# EAGLE board TeenScience-RevB3 (EAGLE 9.5.0), part 1 of 4
TeenScience Teensy Platform
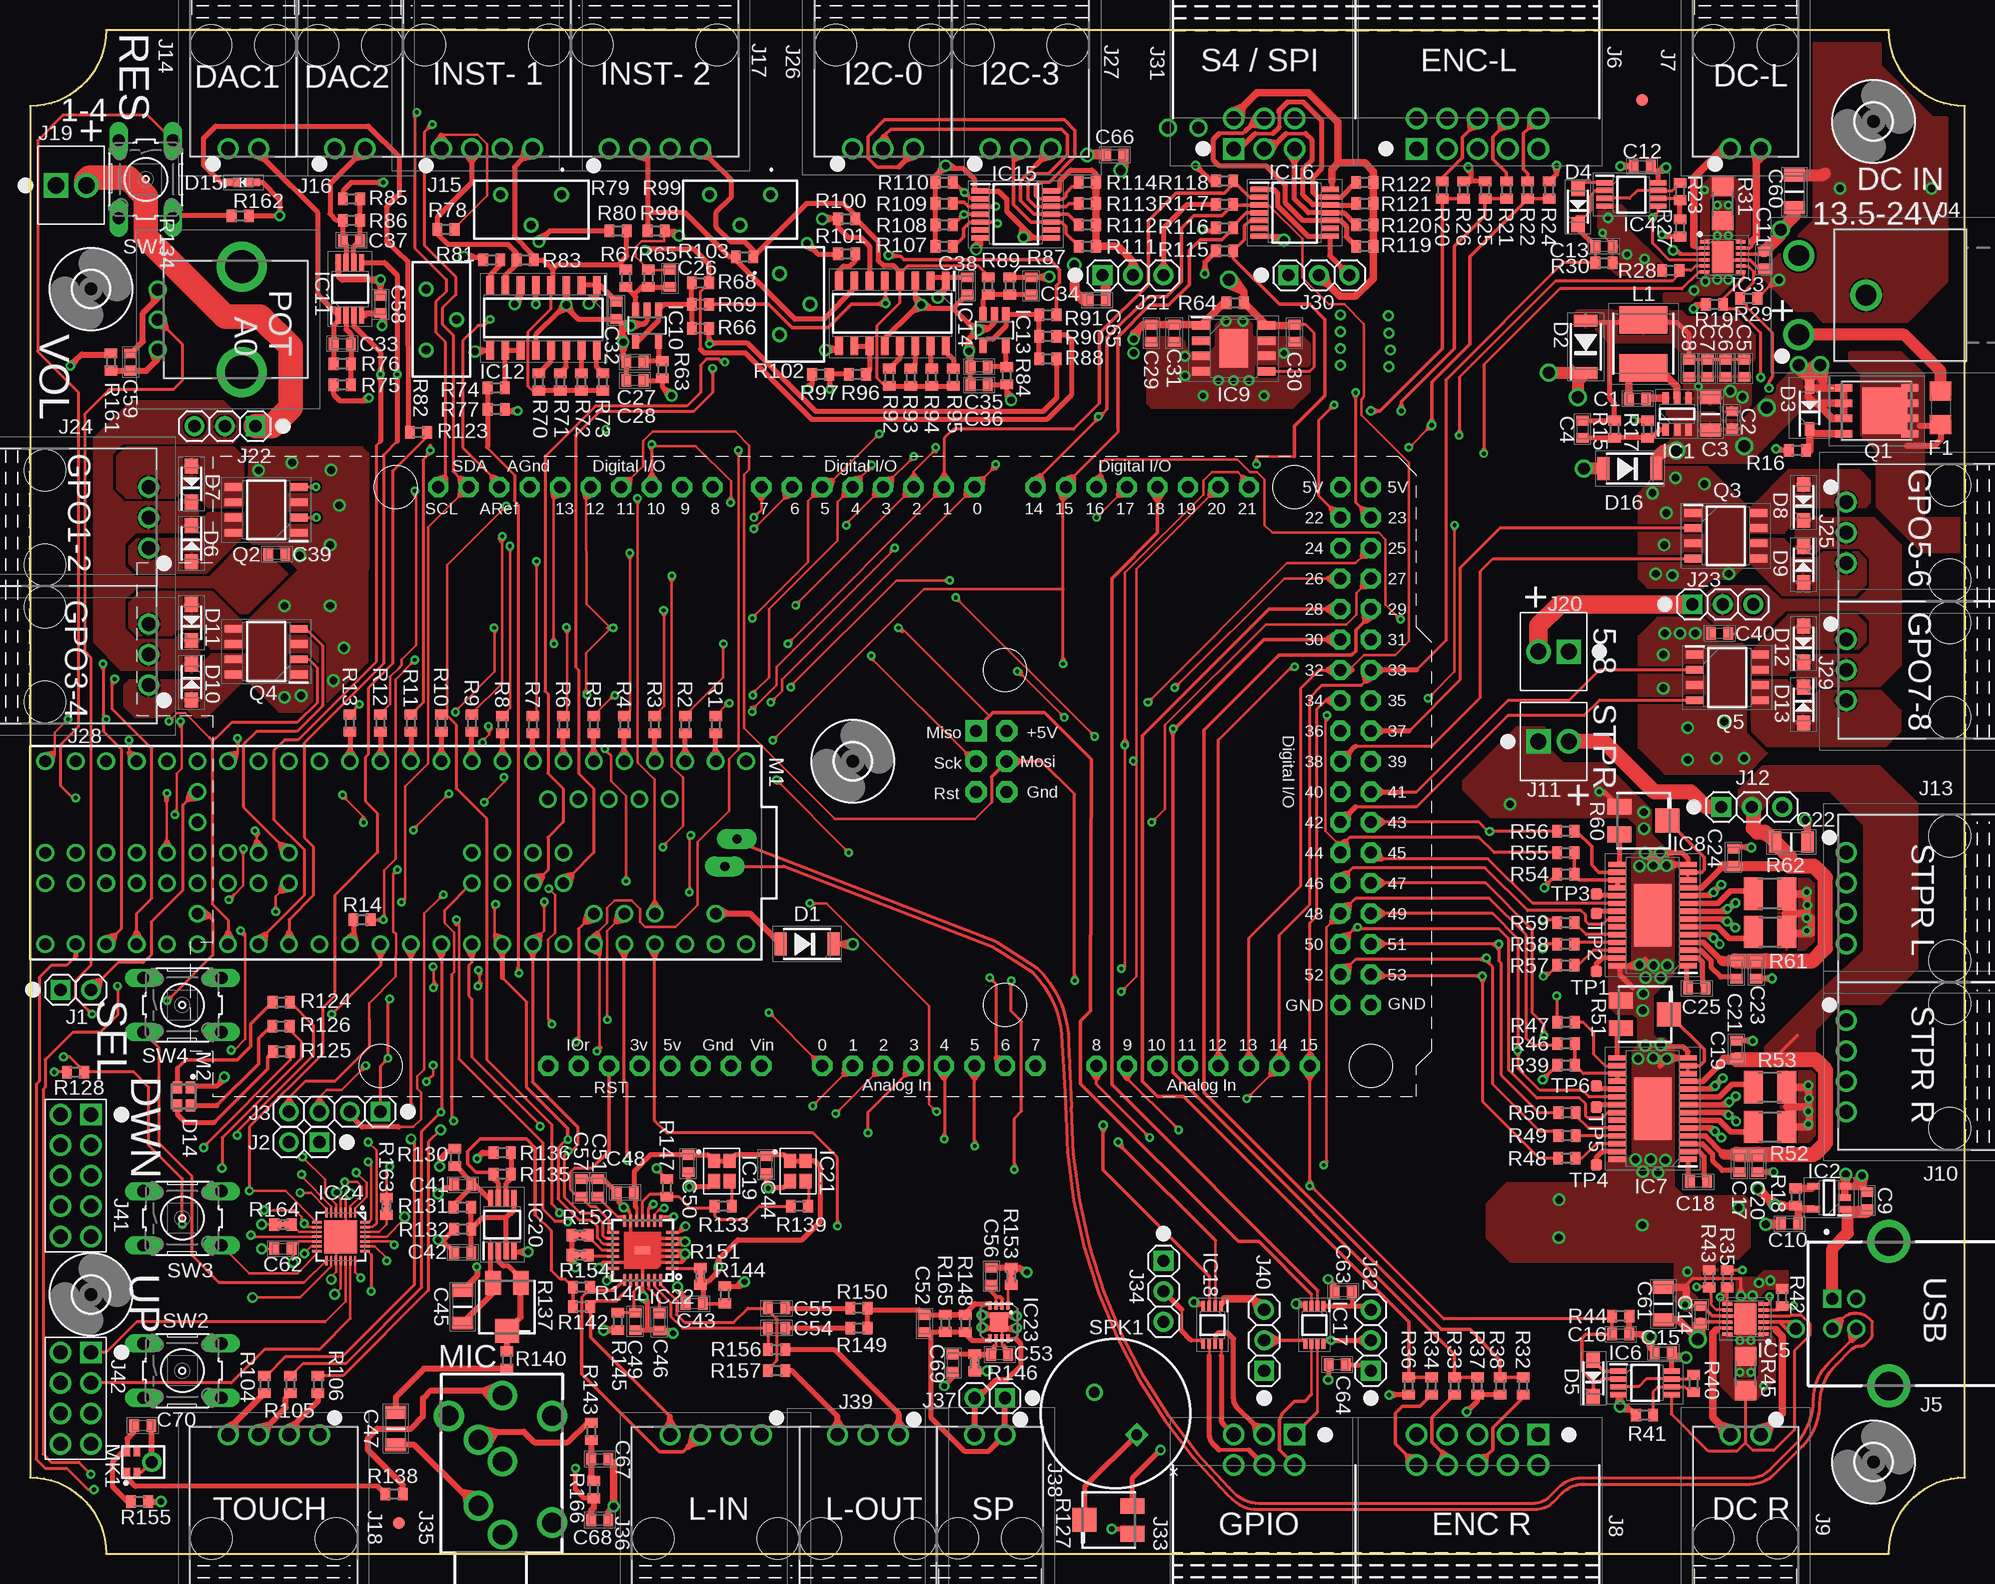
[diagram p5: board, top side]
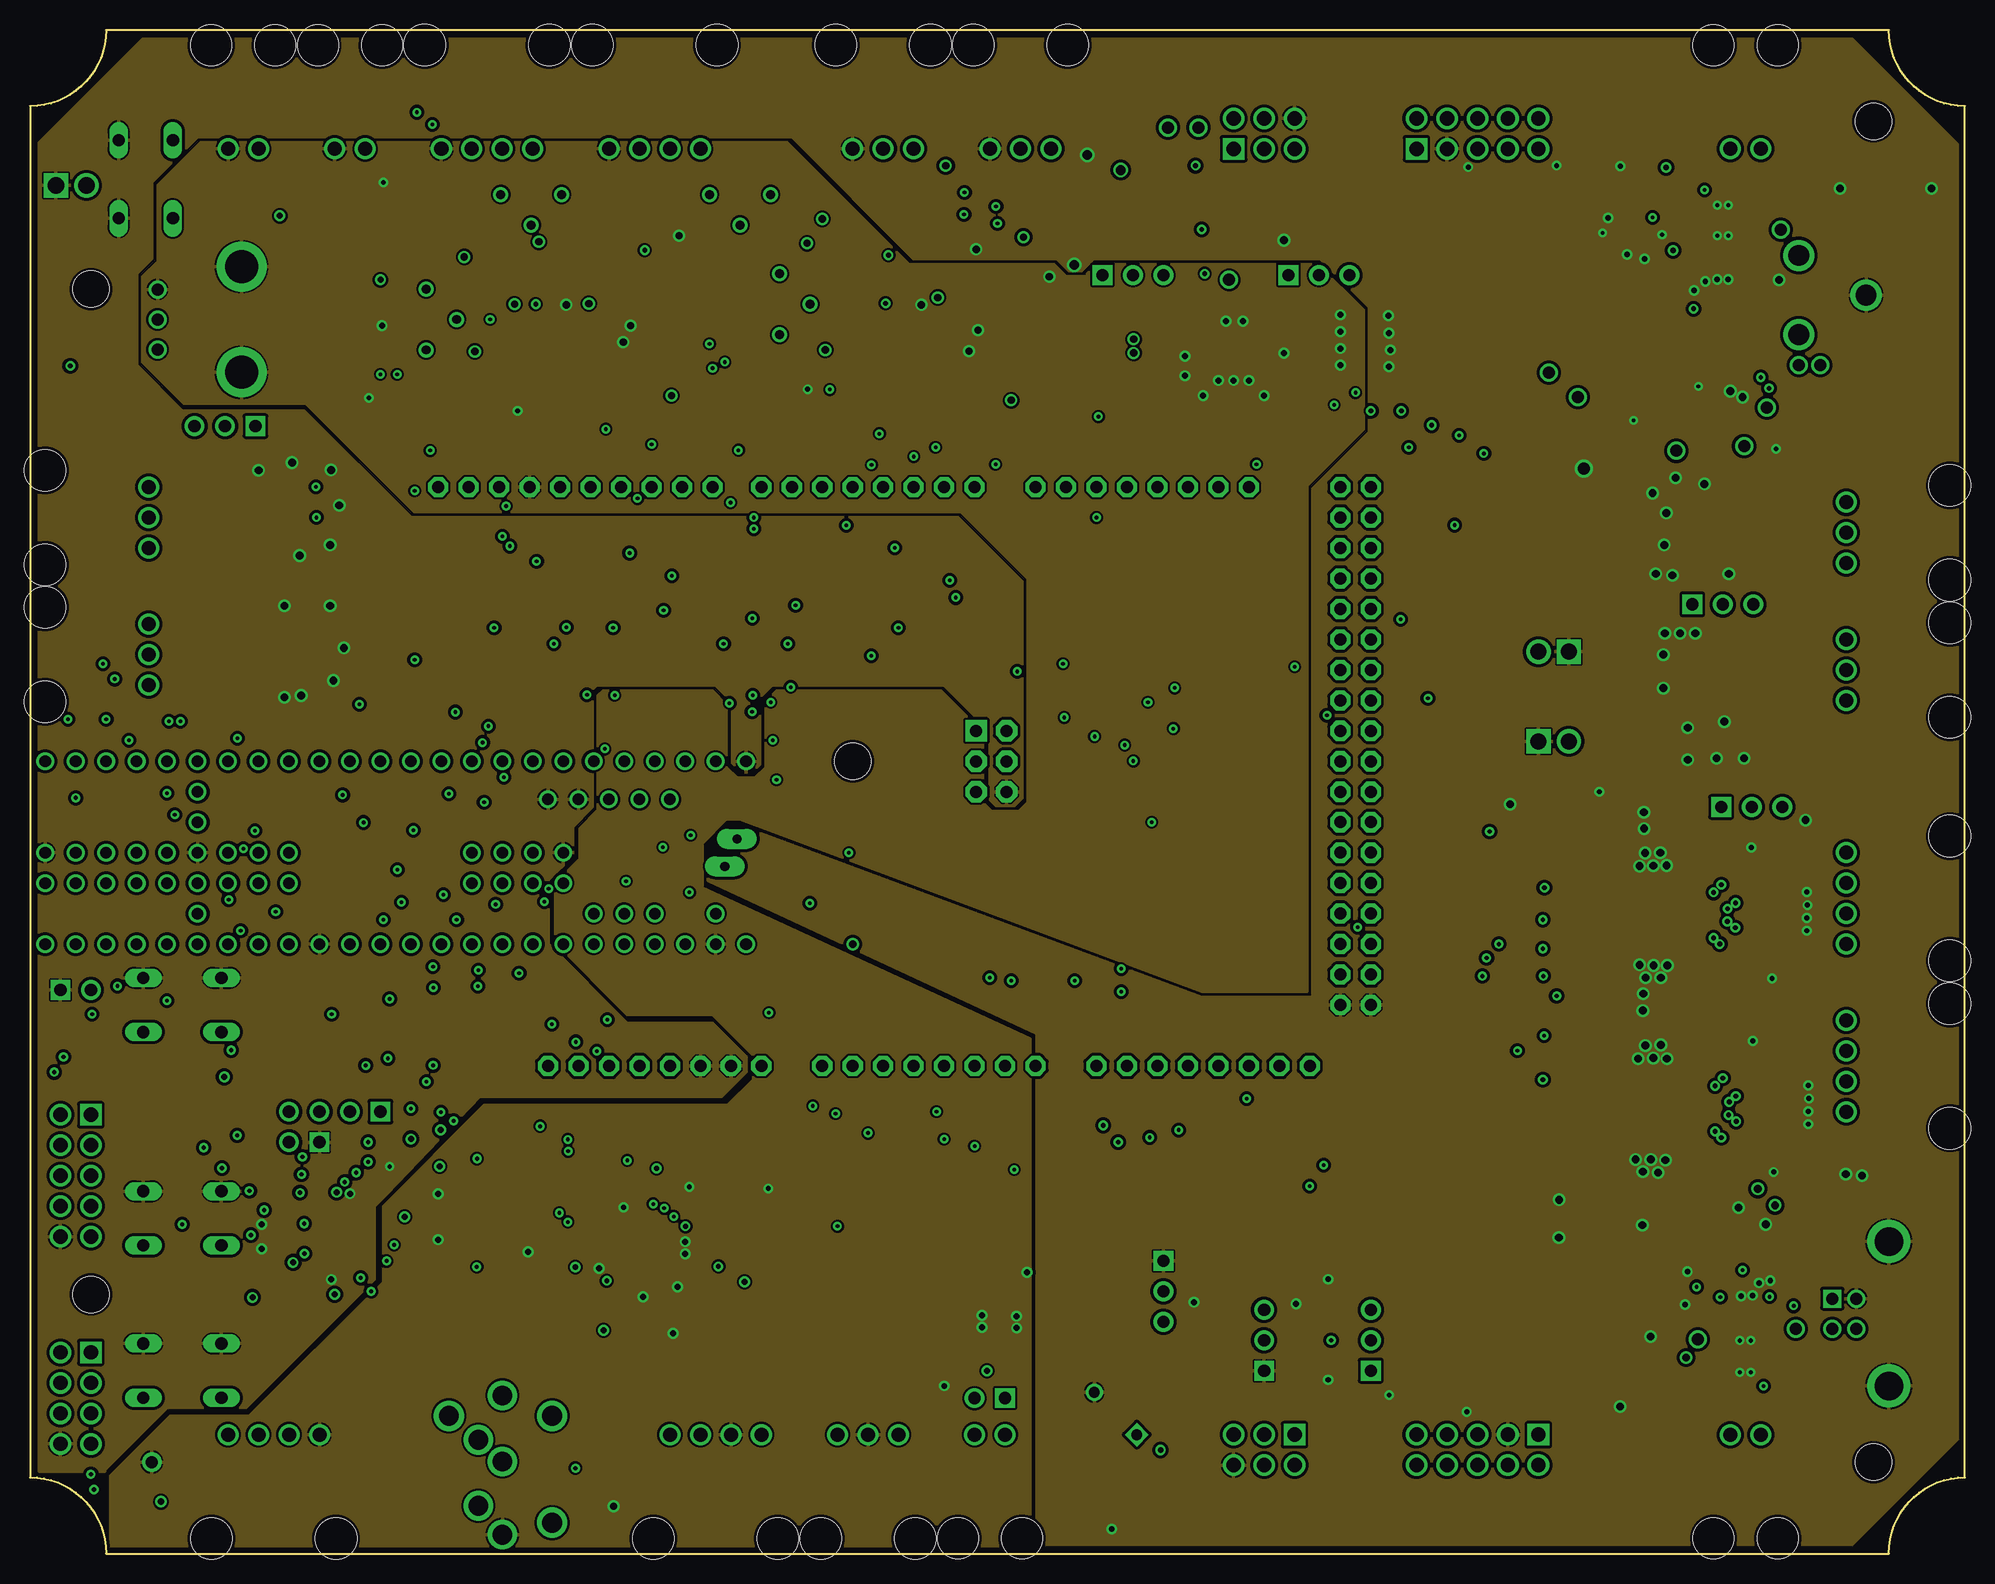
[diagram p6: board, inner layer Route2]
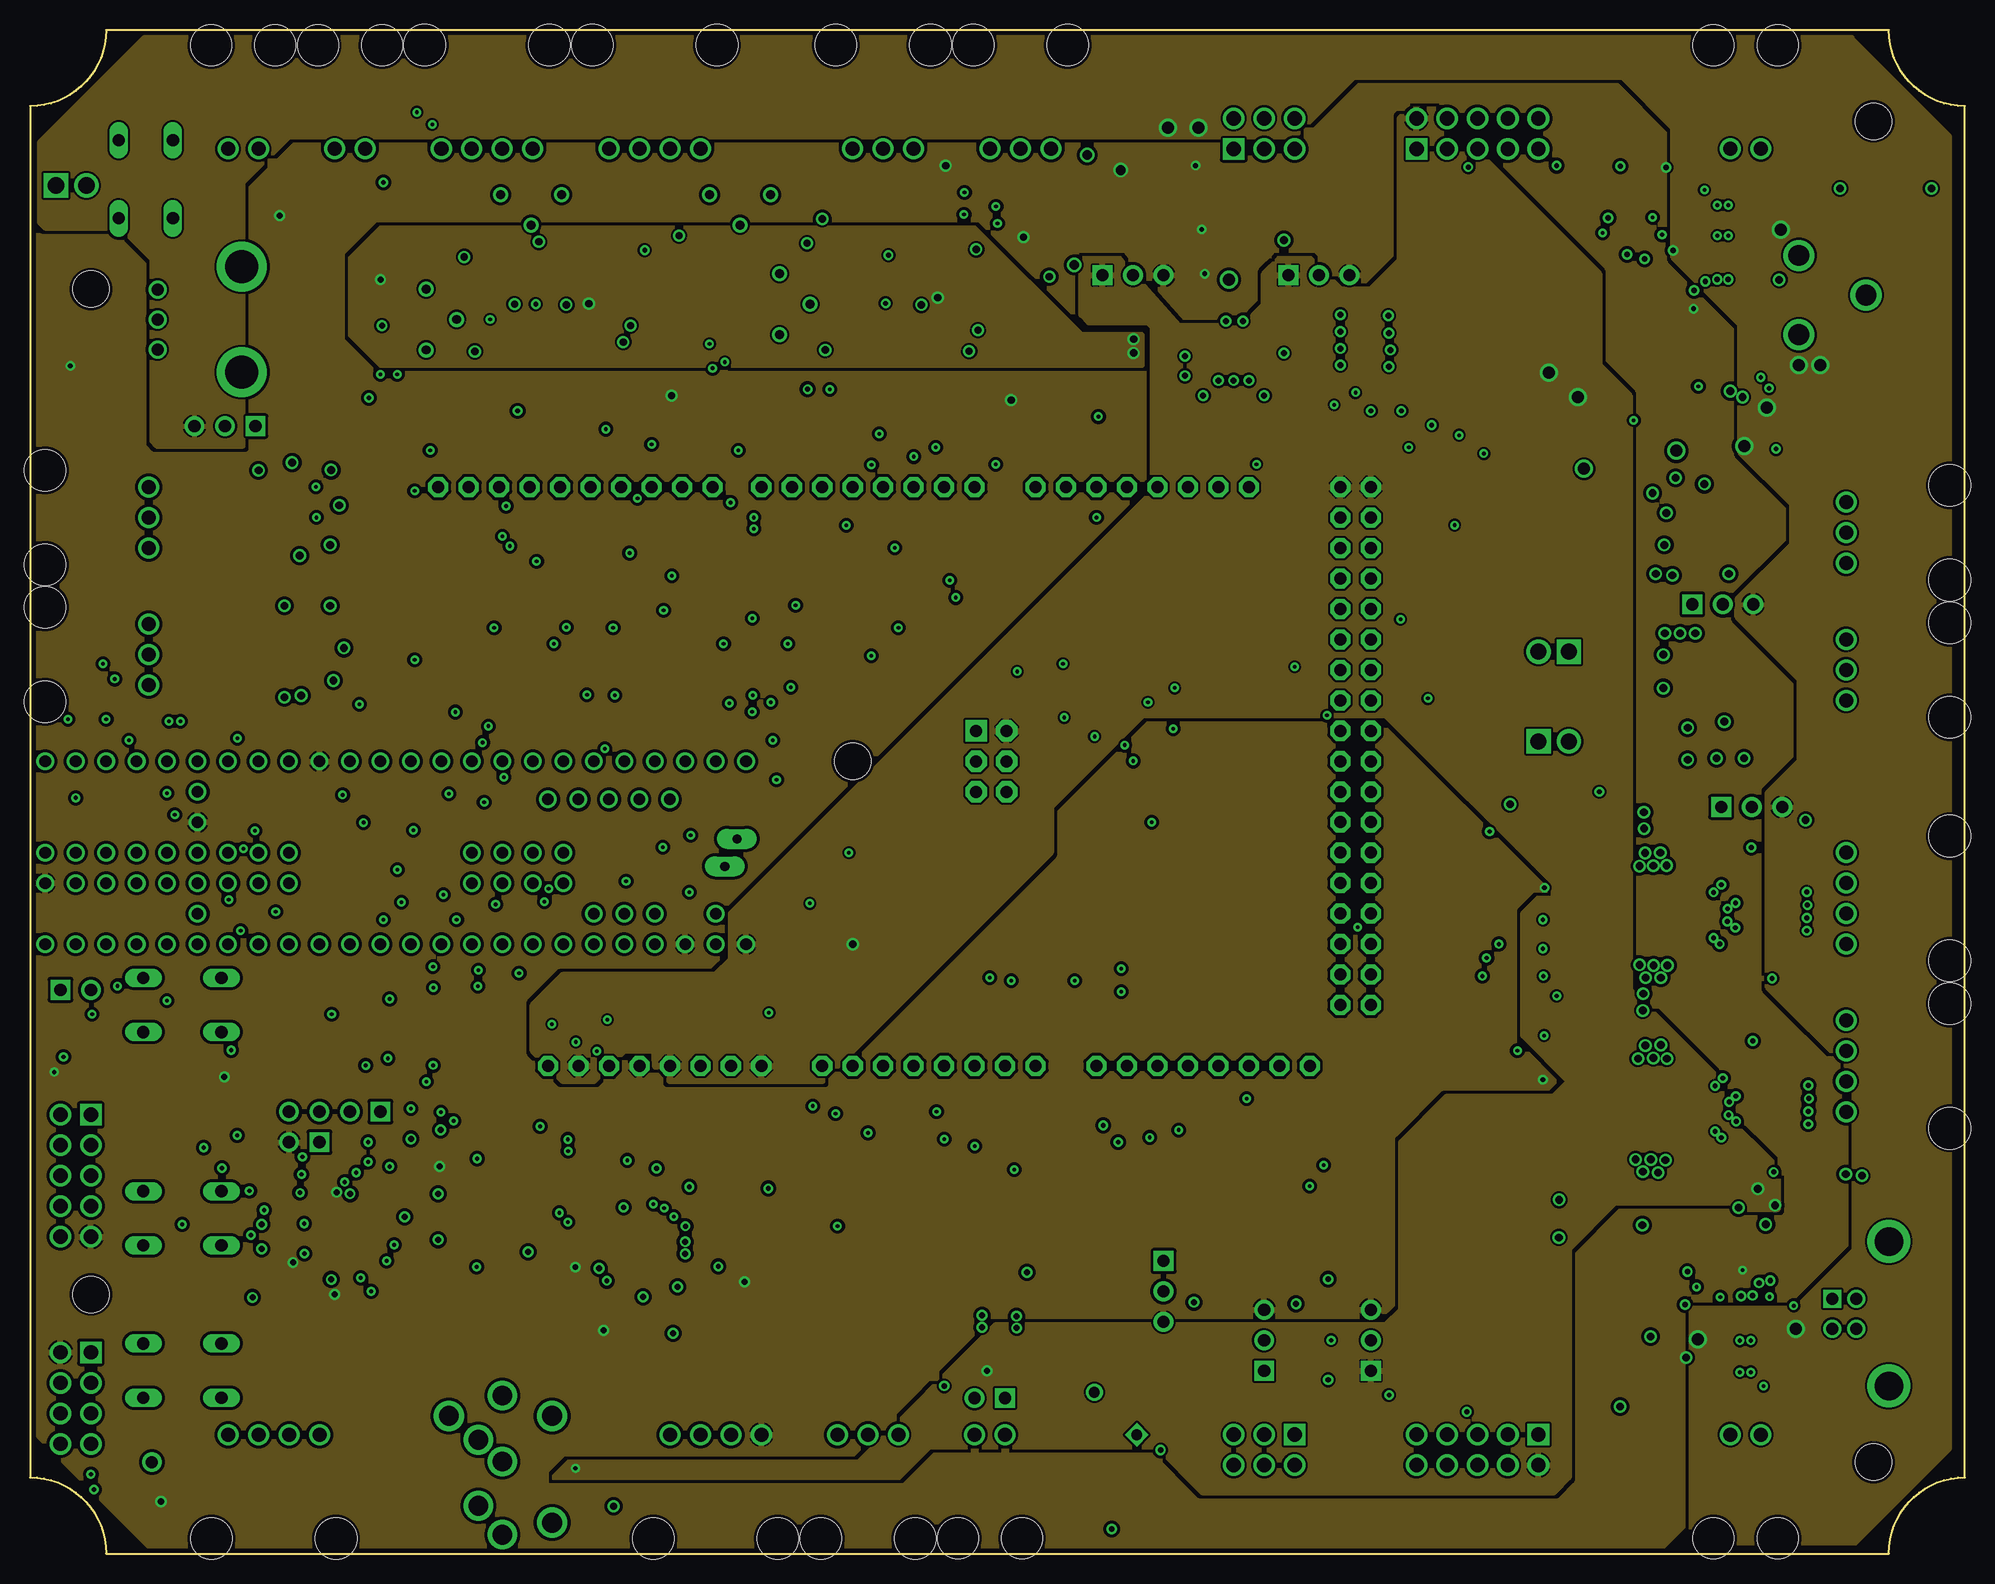
[diagram p7: board, inner layer Route15]
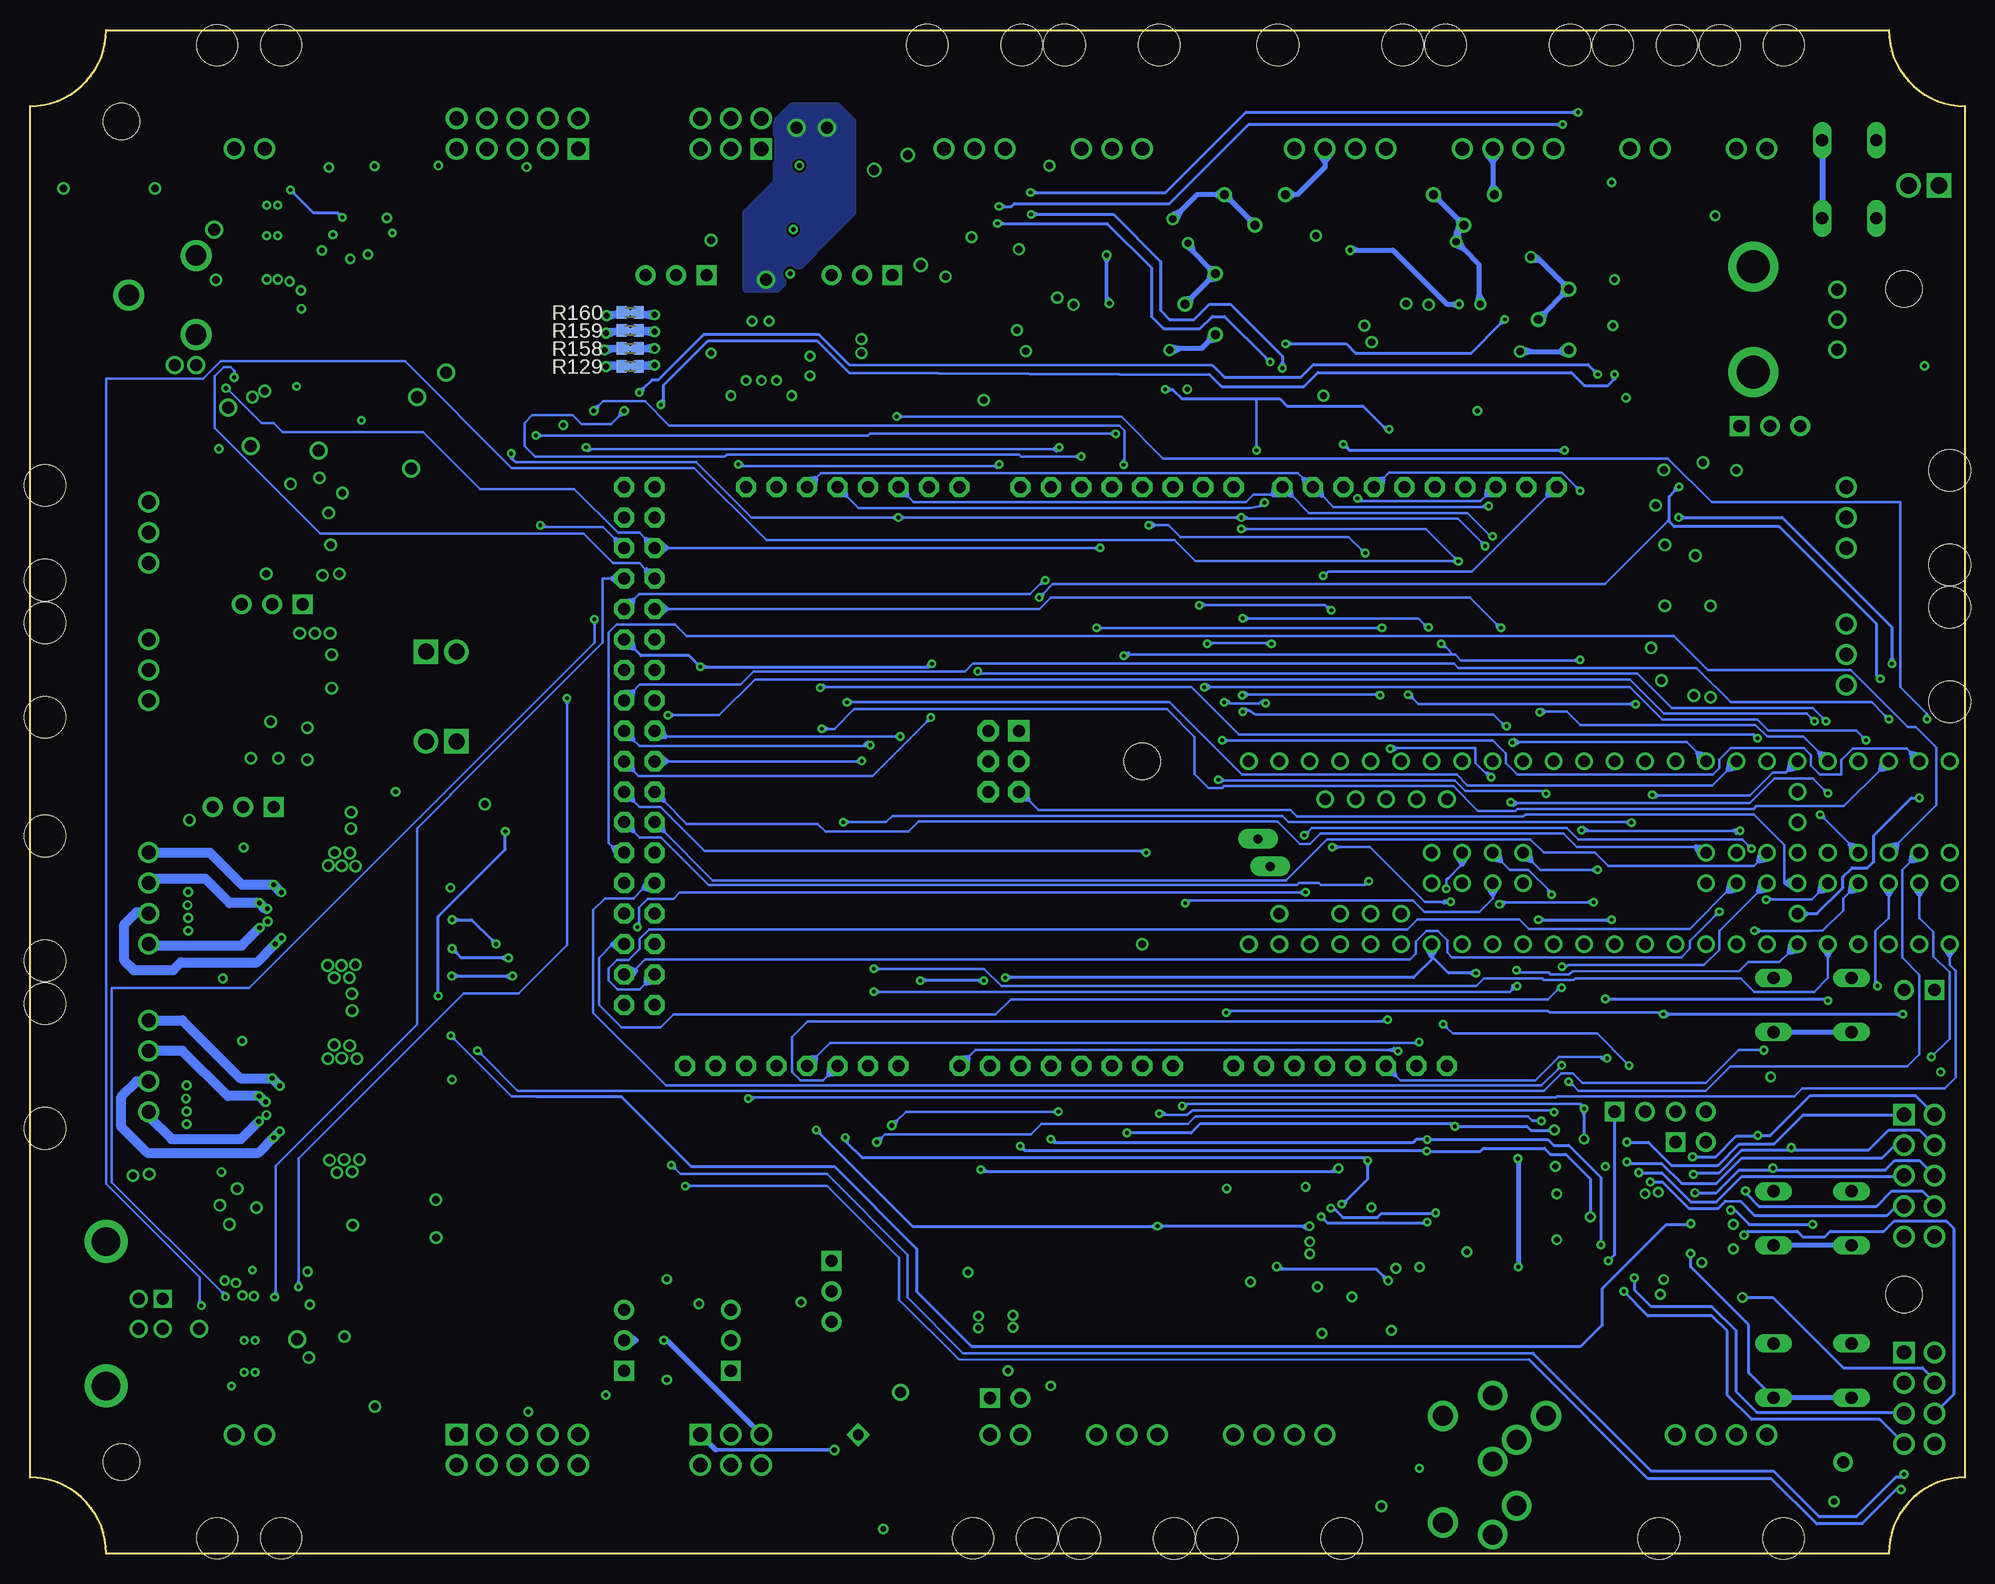
[diagram p8: board, bottom side, seen from below]

Size 161.29 x 127 mm. Coordinates in mm from the lower left corner, seen from the top.
Outline: 161.29,6.35 161.29,120.65 arc-90 154.94,127 6.35,127 arc-90 0,120.65 0,6.35 arc-90 6.35,0 154.94,0 arc-90 161.29,6.35
Copper layers (1+2*15+16): Top 0.035mm / dielectric 0.11mm / Route2 0.035mm / dielectric 1.13mm / Route15 0.035mm / dielectric 0.11mm / Bottom 0.035mm
Design rules "Rickdefault *": minimum track width 0.2mm, minimum drill 12mil, track to track 7mil, track to pad 7mil, pad to pad 0.16001875mm, via to via 8mil, smd to smd 3mil, copper to edge 10mil, drill to drill 6mil, minimum pad ring 10mil, minimum via ring 8mil, stop-mask expansion 4mil, vias tented up to drill 100mil, thermal gap 6mil
vRestrict: area 6.6,70.1 to 27.4,95.8

## Footprints (pad centres in the part's own frame; a part is rotated, then mirrored left to right if it is on the bottom)
MLCC_0603 = smd 0.813 x 1.041: 1 -0.72,0; 2 0.72,0
MLCC_1206 = smd 1.07 x 1.78: 1 -1.36,0; 2 1.36,0
SOD_128_DIODE = smd 1 x 1.93: 1 -2.2,0; 2 2.2,0
SOD3716X135N_DIODE = smd 1.15 x 0.8: 1 -1.75,0; 2 1.75,0
SOD-123FL = smd 1.24 x 1.12: 1 -1.5,0; 2 1.5,0
SON95P2X2X1-RGB_LED = smd 1 x 0.8: 1 0.75,-0.55; 2 -0.75,-0.55; 3 -0.75,0.55; 4 0.75,0.55
LED_0603 = smd 1.1 x 0.65: 1 -0.85,0; 2 0.85,0
1206-3.2X1.6MM = smd 1.6 x 1.8: 1 -1.4,0; 2 1.4,0
SOT95P280X100-6N = smd 1.05 x 0.55: 1 -1.3,0.95; 2 -1.3,0; 3 -1.3,-0.95; 4 1.3,-0.95; 5 1.3,0; 6 1.3,0.95
SOT95P280X100-5N = smd 1.05 x 0.55: 1 -1.3,0.95; 2 -1.3,0; 3 -1.3,-0.95; 4 1.3,-0.95; 5 1.3,0.95
TDFN12-EP = smd 0.8 x 0.3: 1 -1.5,1.25; 2 -1.5,0.75; 3 -1.5,0.25; 4 -1.5,-0.25; 5 -1.5,-0.75; 6 -1.5,-1.25; 7 1.5,-1.25; 8 1.5,-0.75; 9 1.5,-0.25; 10 1.5,0.25; 11 1.5,0.75; 12 1.5,1.25 | smd 1.8 x 2.6: 13 0,0
VSSOP8-DGK-065P = smd 1.4 x 0.45: 1 -2.2,0.975; 2 -2.2,0.325; 3 -2.2,-0.325; 4 -2.2,-0.975; 5 2.2,-0.975; 6 2.2,-0.325; 7 2.2,0.325; 8 2.2,0.975
TSSOP28-PWR = smd 1.475 x 0.45: 1 -2.938,4.225; 2 -2.938,3.575; 3 -2.938,2.925; 4 -2.938,2.275; 5 -2.938,1.625; 6 -2.938,0.975; 7 -2.938,0.325; 8 -2.938,-0.325; 9 -2.938,-0.975; 10 -2.938,-1.625; 11 -2.938,-2.275; 12 -2.938,-2.925; 13 -2.938,-3.575; 14 -2.938,-4.225; 15 2.938,-4.225; 16 2.938,-3.575; 17 2.938,-2.925; 18 2.938,-2.275; 19 2.938,-1.625; 20 2.938,-0.975; 21 2.938,-0.325; 22 2.938,0.325; 23 2.938,0.975; 24 2.938,1.625; 25 2.938,2.275; 26 2.938,2.925; 27 2.938,3.575; 28 2.938,4.225 | smd 3.1 x 5.18: 29 0,0
SOIC8-PAD127P600X100 = smd 1.525 x 0.7: 1 -2.712,1.905; 2 -2.712,0.635; 3 -2.712,-0.635; 4 -2.712,-1.905; 5 2.712,-1.905; 6 2.712,-0.635; 7 2.712,0.635; 8 2.712,1.905 | smd 2.4 x 3.2: 9 0,0
SOT23-5 = smd 0.6 x 1.2: 1 -0.95,-1.306; 2 0,-1.306; 3 0.95,-1.306; 4 0.95,1.306; 5 -0.95,1.306
SOIC16-127P600X175 = smd 1.525 x 0.65: 1 -2.712,4.445; 2 -2.712,3.175; 3 -2.712,1.905; 4 -2.712,0.635; 5 -2.712,-0.635; 6 -2.712,-1.905; 7 -2.712,-3.175; 8 -2.712,-4.445; 9 2.712,-4.445; 10 2.712,-3.175; 11 2.712,-1.905; 12 2.712,-0.635; 13 2.712,0.635; 14 2.712,1.905; 15 2.712,3.175; 16 2.712,4.445
TSSOP14 = smd 1.475 x 0.45: 1 -2.938,1.95; 2 -2.938,1.3; 3 -2.938,0.65; 4 -2.938,0; 5 -2.938,-0.65; 6 -2.938,-1.3; 7 -2.938,-1.95; 8 2.938,-1.95; 9 2.938,-1.3; 10 2.938,-0.65; 11 2.938,0; 12 2.938,0.65; 13 2.938,1.3; 14 2.938,1.95
VSSOP8-DCU-050P = smd 0.85 x 0.3: 1 -1.575,0.75; 2 -1.575,0.25; 3 -1.575,-0.25; 4 -1.575,-0.75; 5 1.575,-0.75; 6 1.575,-0.25; 7 1.575,0.25; 8 1.575,0.75
2.5X2-4-PAD = smd 1.2 x 1: 1 -0.85,-0.65; 2 0.85,-0.65; 3 0.85,0.65; 4 -0.85,0.65
QFN-28-5MM-0.5P-PAD = smd 1 x 0.25: 1 -2.45,1.5; 2 -2.45,1; 3 -2.45,0.5; 4 -2.45,0; 5 -2.45,-0.5; 6 -2.45,-1; 7 -2.45,-1.5; 15 2.45,-1.5; 16 2.45,-1; 17 2.45,-0.5; 18 2.45,0; 19 2.45,0.5; 20 2.45,1; 21 2.45,1.5 | smd 0.25 x 1: 8 -1.5,-2.45; 9 -1,-2.45; 10 -0.5,-2.45; 11 0,-2.45; 12 0.5,-2.45; 13 1,-2.45; 14 1.5,-2.45; 22 1.5,2.45; 23 1,2.45; 24 0.5,2.45; 25 0,2.45; 26 -0.5,2.45; 27 -1,2.45; 28 -1.5,2.45 | smd 1.27 x 0.635: 29 0,0
LFCSP8_3X3 = smd 0.7 x 0.34: 1 -1.375,0.75; 2 -1.375,0.25; 3 -1.375,-0.25; 4 -1.375,-0.75; 5 1.375,-0.75; 6 1.375,-0.25; 7 1.375,0.25; 8 1.375,0.75 | smd 1.6 x 1.6: EXP 0,0
QFN-28-4MM-0.4P-PAD = smd 0.8 x 0.2: 1 -2,1.2; 2 -2,0.8; 3 -2,0.4; 4 -2,0; 5 -2,-0.4; 6 -2,-0.8; 7 -2,-1.2; 15 2,-1.2; 16 2,-0.8; 17 2,-0.4; 18 2,0; 19 2,0.4; 20 2,0.8; 21 2,1.2 | smd 0.2 x 0.8: 8 -1.2,-2; 9 -0.8,-2; 10 -0.4,-2; 11 0,-2; 12 0.4,-2; 13 0.8,-2; 14 1.2,-2; 22 1.2,2; 23 0.8,2; 24 0.4,2; 25 0,2; 26 -0.4,2; 27 -0.8,2; 28 -1.2,2 | smd 2.75 x 2.75: 29 0,0
HDR_1X2 = drill 1.016 pad 1.651 square: 1 -2.54,0 | drill 1.016 pad 1.651: 2 0,0
HDR_1X04 = drill 1.016 pad 1.651 square: 1 -6.35,0 | drill 1.016 pad 1.651: 2 -3.81,0; 3 -1.27,0; 4 1.27,0
DCJACK-721RA = drill 1.73 pad 2.595: 1 0,0; 2 -5.6,-3.3; 3 0,-6.6
USB-B = drill 1 pad 1.5 square: 1 7.27,4.71 | drill 1 pad 1.5: 2 4.77,4.71; 3 4.77,2.71; 4 7.27,2.71 | drill 2.38 pad 3.58: 5 0,0; 6 12.04,0
HDR_2X5M_RAS = drill 1.2 pad 1.8 square: 1 0,0 | drill 1.2 pad 1.8: 2 0,2.54; 3 2.54,0; 4 2.54,2.54; 5 5.08,0; 6 5.08,2.54; 7 7.62,0; 8 7.62,2.54; 9 10.16,0; 10 10.16,2.54
HDR_1X2RAS = drill 1.17 pad 1.755: 1 0,0; 2 -2.54,0 | hole 3.4: -3.94,-8.64; 1.4,-8.64
HDR_1X4RAS = drill 1.17 pad 1.755: 1 0,0; 2 -2.54,0; 3 -5.08,0; 4 -7.62,0 | hole 3.45: -9.01,-8.64; 1.39,-8.64
TE_282834-2_PHOENIX2 = drill 1.36 square: 1 0,0 | drill 1.36: 2 2.54,0
HDR_1X3 = drill 1.016 pad 1.651 square: 1 -2.54,0 | drill 1.016 pad 1.651: 2 0,0; 3 2.54,0
HDR_1X3RAS = drill 1.17 pad 1.755: 1 0,0; 2 -2.54,0; 3 -5.08,0 | hole 3.45: -6.48,-8.64; 1.4,-8.64
HDR_2X3M_RAS = drill 1.2 pad 1.8 square: 1 -5.08,0 | drill 1.2 pad 1.8: 2 -5.08,2.54; 3 -2.54,0; 4 -2.54,2.54; 5 0,0; 6 0,2.54
AUDIO-JACK-SJ1-3533NS = drill 1.651 pad 2.286: 1 -0.002,-0.005; 2 2.398,1.995; 3 7.898,1.995; 5 6.098,-0.005 | drill 1.651 pad 2.3: 4 11.598,-0.005 | drill 1.651 pad 2.54: 6 9.898,4.45; 7 9.898,-4.15; 8 0.998,-4.15
HDR_2X5M-RAHDR = drill 1.19 pad 1.79 square: 1 10.16,0 | drill 1.19 pad 1.79: 2 10.16,2.54; 3 7.62,0; 4 7.62,2.54; 5 5.08,0; 6 5.08,2.54; 7 2.54,0; 8 2.54,2.54; 9 0,0; 10 0,2.54
HDR_2X4M-RAHDR = drill 1.19 pad 1.79 square: 1 7.62,0 | drill 1.19 pad 1.79: 2 7.62,2.54; 3 5.08,0; 4 5.08,2.54; 5 2.54,0; 6 2.54,2.54; 7 0,0; 8 0,2.54
IND_5X5MM-5045 = smd 2.3 x 4: 1 -2,0; 2 2,0
TEENSY_3.6_ALL_PINS&PADS = drill 0.965: 0 -7.62,26.67; 1 -7.62,24.13; 2 -7.62,21.59; 3 -7.62,19.05; 3.3V 7.62,24.13; 3.3V2 2.54,-29.21; 3.3V3 -7.62,-6.35; 3.3V4 -2.54,-16.51; 4 -7.62,16.51; 5 -7.62,13.97; 6 -7.62,11.43; 7 -7.62,8.89; 8 -7.62,6.35; 9 -7.62,3.81; 10 -7.62,1.27; 11 -7.62,-1.27; 12 -7.62,-3.81; 13 7.62,-3.81; 14/A0 7.62,-1.27; 15/A1 7.62,1.27; 16/A2 7.62,3.81; 17/A3 7.62,6.35; 18/A4 7.62,8.89; 19/A5 7.62,11.43; 20/A6 7.62,13.97; 21/A7 7.62,16.51; 22/A8 7.62,19.05; 23/A9 7.62,21.59; 24 -7.62,-8.89; 25 -7.62,-11.43; 26 -7.62,-13.97; 27 -7.62,-16.51; 28 -7.62,-19.05; 29 -7.62,-21.59; 30 -7.62,-24.13; 31/A12 -7.62,-26.67; 32/A13 -7.62,-29.21; 33/A14 7.62,-29.21; 34/A15 7.62,-26.67; 35/A16 7.62,-24.13; 36/A17 7.62,-21.59; 37/A18 7.62,-19.05; 38/A19 7.62,-16.51; 39/A20 7.62,-13.97; 40 0,-8.89; 41 0,-11.43; 42 0,-13.97; 43 0,-19.05; 44 0,-21.59; 45 0,-24.13; 46 0,-26.67; 47 2.54,-26.67; 48 2.54,-24.13; 49 2.54,-21.59; 50 2.54,-19.05; 51 2.54,-13.97; 52 2.54,-11.43; 53 2.54,-8.89; 54 2.54,6.35; 55 2.54,8.89; 56 2.54,11.43; 57 2.54,13.97; A10 5.08,19.05; A11 5.08,16.51; A21 7.62,-11.43; A22 7.62,-8.89; AGND 7.62,26.67; AREF 5.08,21.59; DC 0,8.89; DD 0,6.35; DE 0,11.43; GND -7.62,29.21; GND1 7.62,-6.35; GND2 0,13.97; GND3 -4.445,15.24; GND4 -4.445,12.7; GND5 0,-29.21; GND6 0,-16.51; PGM 2.54,-16.51; RESET 5.08,-16.51; USB1+ -4.445,17.78; USB1- -4.445,20.32; VBAT -5.08,-16.51; VIN 7.62,29.21; VUSB 5.08,26.67; VUSB1 -4.445,22.86 | drill 0.762 pad 1.651 long: USB0+ -1.143,28.448; USB0- 1.143,27.432
ARDUINO_MEGA_ICSP = drill 1 pad 1.676 octagon: 3V 35.56,2.54; 5V 38.1,2.54; 5V@1 93.98,50.8; 5V@2 96.52,50.8; A0 50.8,2.54; A1 53.34,2.54; A2 55.88,2.54; A3 58.42,2.54; A4 60.96,2.54; A5 63.5,2.54; A6 66.04,2.54; A7 68.58,2.54; A8 73.66,2.54; A9 76.2,2.54; A10 78.74,2.54; A11 81.28,2.54; A12 83.82,2.54; A13 86.36,2.54; A14 88.9,2.54; A15 91.44,2.54; AGND 26.416,50.8; AREF 23.876,50.8; D0 63.5,50.8; D1 60.96,50.8; D2 58.42,50.8; D3 55.88,50.8; D4 53.34,50.8; D5 50.8,50.8; D6 48.26,50.8; D7 45.72,50.8; D8 41.656,50.8; D9 39.116,50.8; D10 36.576,50.8; D11 34.036,50.8; D12 31.496,50.8; D13 28.956,50.8; D14 68.58,50.8; D15 71.12,50.8; D16 73.66,50.8; D17 76.2,50.8; D18 78.74,50.8; D19 81.28,50.8; D20 83.82,50.8; D21 86.36,50.8; D22 93.98,48.26; D23 96.52,48.26; D24 93.98,45.72; D25 96.52,45.72; D26 93.98,43.18; D27 96.52,43.18; D28 93.98,40.64; D29 96.52,40.64; D30 93.98,38.1; D31 96.52,38.1; D32 93.98,35.56; D33 96.52,35.56; D34 93.98,33.02; D35 96.52,33.02; D36 93.98,30.48; D37 96.52,30.48; D38 93.98,27.94; D39 96.52,27.94; D40 93.98,25.4; D41 96.52,25.4; D42 93.98,22.86; D43 96.52,22.86; D44 93.98,20.32; D45 96.52,20.32; D46 93.98,17.78; D47 96.52,17.78; D48 93.98,15.24; D49 96.52,15.24; D50 93.98,12.7; D51 96.52,12.7; D52 93.98,10.16; D53 96.52,10.16; GND@1 43.18,2.54; GND@2 40.64,2.54; GND@4 93.98,7.62; GND@5 96.52,7.62; IOREF 30.48,2.54; RESERVED 27.94,2.54; RESET 33.02,2.54; SCL 18.796,50.8; SDA 21.336,50.8; VIN 45.72,2.54 | drill 1 pad 1.778 octagon: 5V_ICSP 66.167,30.48; GND@3 66.167,25.4; MOSI 66.167,27.94; RESET_ICSP 63.627,25.4; SCK 63.627,27.94 | drill 1 pad 1.778 square: MISO 63.627,30.48
SPH6611_MEMS_2.65X3.50 = smd 0.73 x 0.53: 1 -0.838,1.363; 2 -0.838,0.541; 4 0.838,0.541; 5 0.838,1.363 | drill 1 pad 1.625: 3 0,-0.711
FDN8_5.1X6.3 = smd 0.61 x 1.42: 1 -1.905,-2.745; 2 -0.635,-2.745; 3 0.635,-2.745; 4 1.905,-2.745 | smd 0.61 x 0.92: 5 1.905,2.995; 6 0.635,2.995; 7 -0.635,2.995; 8 -1.905,2.995 | smd 3.91 x 3.75: 9 0,0.66 | smd 0.255 x 0.5: 10 -2.082,2.285; 11 2.082,2.285
SOIC8-127P60 = smd 1.5 x 0.65: 1 -2.7,1.905; 2 -2.7,0.635; 3 -2.7,-0.635; 4 -2.7,-1.905; 5 2.7,-1.905; 6 2.7,-0.635; 7 2.7,0.635; 8 2.7,1.905
R0603 = smd 0.813 x 1.041: 1 -0.72,0; 2 0.72,0
R1206 = smd 1.6 x 1.803: 1 -1.422,0; 2 1.422,0
SM-4.5X4.5-TRIM = smd 2 x 1.3: 1 2,1.15; 3 2,-1.15 | smd 2 x 2: 2 -2,0
R1210 = smd 1.6 x 2.7: 1 -1.4,0; 2 1.4,0
PV36YTRIMMER = drill 0.74 pad 1.24: 1 1.27,-2.54; 2 -1.27,0; 3 1.27,2.54
R0603-SHORT = smd 0.813 x 1.041: 1 -0.72,0; 2 0.72,0 | smd 0.864 x 0.635: P$1 -0.381,0; P$2 0.381,0
RK09-ALPS-VERT-POT = drill 1 pad 1.5: 1 -2.5,-5.875; 2 0,-5.875; 3 2.5,-5.875 | drill 2.766 pad 4.149: MH1 -4.4,1.125; MH2 4.4,1.125
BUZZER-5MM-12.4D = drill 0.9 pad 1.4 square: 1 2.5,0 | drill 0.9 pad 1.4: 2 -2.5,0
SWITCH_TAC_6MM = drill 1.016 long: 1 -3.251,2.261; 2 3.251,2.261; 3 -3.251,-2.261; 4 3.251,-2.261
SMT_TEST = smd 0.965 x 0.457: NC1 0,-0.254; NC3 0,0.254 | smd 0.457 x 0.965: NC2 0.254,0; TP -0.254,0
3,0 = hole 3: 0,0
FIDUCIAL_1MM = smd 1 x 1: 1 0,0

## Placement (x,y rotation side)
C1  0.10uF  [MLCC_0603]  133.99,96.27 180 top
C2  0.10uF  [MLCC_0603]  141.86,94.49 90 top
C3  10uF  [MLCC_1206]  140.08,95 90 top
C4  47pF  [MLCC_0603]  129.41,93.73 90 top
C5  10uF  [MLCC_0603]  142.88,98.81 90 top
C6  10uF  [MLCC_0603]  141.35,98.81 90 top
C7  10uF  [MLCC_0603]  139.83,98.81 90 top
C8  10uF  [MLCC_0603]  138.3,98.81 90 top
C9  1uF  [MLCC_0603]  153.11,29.41 90 top
C10  10uF  [MLCC_0603]  146.66,27.48 0 top
C11  0.10uF  [MLCC_0603]  144.53,107.82 90 top
C12  0.10uF  [MLCC_0603]  134.39,115.65 0 top
C13  1uF  [MLCC_0603]  131.19,108.97 180 top
C14  0.10uF  [MLCC_0603]  139.24,19.91 270 top
C15  0.10uF  [MLCC_0603]  136.14,16.76 0 top
C16  1uF  [MLCC_0603]  132.59,18.29 180 top
C17  0.10uF  [MLCC_0603]  142.49,32.51 90 top
C18  0.010uF  [MLCC_0603]  139.06,30.99 180 top
C19  0.10uF  [MLCC_0603]  142.24,42.04 270 top
C20  0.10uF  [MLCC_0603]  144.02,32.51 90 top
C21  0.10uF  [MLCC_0603]  142.24,48.64 90 top
C22  10uF  [MLCC_1206]  146.81,59.31 180 top
C23  0.10uF  [MLCC_0603]  143.89,48.64 90 top
C24  0.10uF  [MLCC_0603]  141.99,58.04 270 top
C25  0.010uF  [MLCC_0603]  138.94,47.12 180 top
C26  1uF  [MLCC_0603]  53.34,106.3 270 top
C27  1uF  [MLCC_0603]  50.42,99.31 0 top
C28  0.10uF  [MLCC_0603]  50.42,97.79 0 top
C29  1uF  [MLCC_0603]  93.47,101.73 270 top
C30  0.10uF  [MLCC_0603]  105.41,101.73 90 top
C31  0.10uF  [MLCC_0603]  95.38,101.73 90 top
C32  0.10uF  [MLCC_0603]  48.9,103.63 90 top
C33  47pF  [MLCC_0603]  26.04,100.84 180 top
C34  1uF  [MLCC_0603]  83.44,105.66 270 top
C35  1uF  [MLCC_0603]  79.12,98.93 0 top
C36  0.10uF  [MLCC_0603]  79.12,97.41 0 top
C37  47pF  [MLCC_0603]  26.8,109.47 180 top
C38  0.10uF  [MLCC_0603]  78.11,105.66 90 top
C39  0.10uF  [MLCC_0603]  20.57,83.31 180 top
C40  0.10uF  [MLCC_0603]  140.84,76.71 0 top
C41  10uF  [MLCC_0603]  36.07,30.73 180 top
C42  1uF  [MLCC_0603]  36.07,25.1 180 top
C43  0.10uF  [MLCC_0603]  55.37,20.83 0 top
C44  0.10uF  [MLCC_0603]  61.37,32.41 90 top
C45  10uF  [MLCC_1206]  36.07,20.57 270 top
C46  1uF  [MLCC_0603]  52.45,19.3 270 top
C47  10uF  [MLCC_1206]  30.48,10.41 270 top
C48  0.10uF  [MLCC_0603]  49.61,30.1 0 top
C49  10uF  [MLCC_0603]  50.44,19.35 270 top
C50  10uF  [MLCC_0603]  54.86,32.51 270 top
C51  10uF  [MLCC_0603]  47.35,30.48 90 top
C52  47pF  [MLCC_0603]  74.55,19.18 270 top
C53  0.10uF  [MLCC_0603]  80.82,16.59 0 top
C54  10uF  [MLCC_0603]  62.23,18.8 0 top
C55  10uF  [MLCC_0603]  62.23,20.45 0 top
C56  10uF  [MLCC_0603]  80.14,23.11 270 top
C57  0.10uF  [MLCC_0603]  45.95,30.48 270 top
C58  0.10uF  [MLCC_0603]  29.21,104.14 90 top
C59  1uF  [MLCC_0603]  8.38,99.31 90 top
C60  10uF  [MLCC_1206]  147.07,113.54 90 top
C61  10uF  [MLCC_1206]  136.14,20.83 90 top
C62  0.10uF  [MLCC_0603]  21.08,25.4 0 top
C63  0.10uF  [MLCC_0603]  109.47,21.84 0 top
C64  0.10uF  [MLCC_0603]  108.97,15.75 0 top
C65  0.10uF  [MLCC_0603]  88.95,104.5 0 top
C66  0.10uF  [MLCC_0603]  90.42,116.59 0 top
C67  10uF  [MLCC_0603]  47.5,7.87 180 top
C68  10uF  [MLCC_0603]  47.5,2.79 180 top
C69  10uF  [MLCC_0603]  76.94,15.88 90 top
C70  1uF  [MLCC_0603]  9.4,10.67 0 top
D1  PMEG3030  [SOD_128_DIODE]  64.77,50.8 180 top
D2  PMEG3030  [SOD_128_DIODE]  129.67,100.58 90 top
D3  9.1V  [SOD3716X135N_DIODE]  148.34,95.5 90 top
D4  PMEG2010  [SOD-123FL]  129.03,112.27 90 top
D5  PMEG2010  [SOD-123FL]  130.3,14.61 90 top
D6  NHP220  [SOD-123FL]  13.46,84.2 270 top
D7  NHP220  [SOD-123FL]  13.46,89.15 90 top
D8  NHP220  [SOD-123FL]  147.83,87.63 90 top
D9  NHP220  [SOD-123FL]  147.83,82.42 270 top
D10  NHP220  [SOD-123FL]  13.46,72.64 270 top
D11  NHP220  [SOD-123FL]  13.46,77.6 90 top
D12  NHP220  [SOD-123FL]  147.83,75.82 90 top
D13  NHP220  [SOD-123FL]  147.83,70.74 270 top
D14  RGB  [SON95P2X2X1-RGB_LED]  12.83,38.1 90 top
D15  Green  [LED_0603]  17.78,114.3 0 top
D16  PMEG3030  [SOD_128_DIODE]  133.35,90.42 180 top
F1  F3A  [1206-3.2X1.6MM]  159.26,95.5 270 top
IC1  AP63200  [SOT95P280X100-6N]  137.29,95 90 top
IC2  LTC4411  [SOT95P280X100-5N]  149.96,29.67 180 top
IC3  MAX14870  [TDFN12-EP]  141.1,108.08 0 top
IC4  TLV2172  [VSSOP8-DGK-065P]  133.48,113.28 0 top
IC5  MAX14870  [TDFN12-EP]  142.98,19.56 180 top
IC6  TLV2172  [VSSOP8-DGK-065P]  134.62,14.22 0 top
IC7  DRV8825PWPR  [TSSOP28-PWR]  135.25,37.08 180 top
IC8  DRV8825PWPR  [TSSOP28-PWR]  135.25,53.21 180 top
IC9  BDJ2FC0  [SOIC8-PAD127P600X100]  100.33,100.46 0 top
IC10  LT1797  [SOT23-5]  51.44,102.36 180 top
IC11  TLV2172  [VSSOP8-DGK-065P]  26.67,105.41 90 top
IC12  INA125  [SOIC16-127P600X175]  42.8,103 270 top
IC13  LT1797  [SOT23-5]  80.39,101.98 180 top
IC14  INA125  [SOIC16-127P600X175]  71.88,103.38 270 top
IC15  LSF0204  [TSSOP14]  82.17,111.63 0 top
IC16  LSF0204  [TSSOP14]  105.41,111.76 0 top
IC17  74LVC2T45  [VSSOP8-DCU-050P]  107.06,19.05 270 top
IC18  74LVC2T45  [VSSOP8-DCU-050P]  98.55,19.05 270 top
IC19  24.576MHz  [2.5X2-4-PAD]  57.66,31.88 270 top
IC20  TLV2172  [VSSOP8-DGK-065P]  39.37,27.43 90 top
IC21  11.2896MHz  [2.5X2-4-PAD]  64.01,31.88 270 top
IC22  AK4558EN  [QFN-28-5MM-0.5P-PAD]  51.05,25.27 180 top
IC23  SSM2211  [LFCSP8_3X3]  80.77,19.3 270 top
IC24  SX1509  [QFN-28-4MM-0.4P-PAD]  25.91,26.42 270 top
J1  HDR 1x2 ST-M  [HDR_1X2]  5.08,46.99 0 top
J2  HDR 1x2 ST-M  [HDR_1X2]  21.59,34.29 180 top
J3  HDR 1x4 ST-M  [HDR_1X04]  22.86,36.83 180 top
J4  2.1 ID  [DCJACK-721RA]  147.45,101.6 180 top
J5  USB-B-RA  [USB-B]  154.94,13.97 90 top
J6  HDR 2X5 RA-M  [HDR_2X5M_RAS]  115.57,117.09 0 top
J7  HDR 1X2 RA-M  [HDR_1X2RAS]  141.73,117.09 180 top
J8  HDR 2X5 RA-M  [HDR_2X5M_RAS]  125.73,9.91 180 top
J9  HDR 1X2 RA-M  [HDR_1X2RAS]  144.27,9.91 0 top
J10  HDR 1X4 RA-M  [HDR_1X4RAS]  151.38,44.45 90 top
J11  Phoenix 1X2  [TE_282834-2_PHOENIX2]  125.73,67.69 0 top
J12  HDR 1x3 ST-M  [HDR_1X3]  143.51,62.23 0 top
J13  HDR 1X4 RA-M  [HDR_1X4RAS]  151.38,58.42 90 top
J14  HDR 1X2 RA-M  [HDR_1X2RAS]  16.51,117.09 180 top
J15  HDR 1X4 RA-M  [HDR_1X4RAS]  34.29,117.09 180 top
J16  HDR 1X2 RA-M  [HDR_1X2RAS]  25.4,117.09 180 top
J17  HDR 1X4 RA-M  [HDR_1X4RAS]  48.26,117.09 180 top
J18  HDR 1X4 RA-M  [HDR_1X4RAS]  24.13,9.91 0 top
J19  Phoenix 1X2  [TE_282834-2_PHOENIX2]  2.16,114.05 0 top
J20  Phoenix 1X2  [TE_282834-2_PHOENIX2]  128.27,75.18 180 top
J21  HDR 1x3 ST-M  [HDR_1X3]  91.95,106.55 0 top
J22  HDR 1x3 ST-M  [HDR_1X3]  16.26,93.98 180 top
J23  HDR 1x3 ST-M  [HDR_1X3]  141.1,79.12 0 top
J24  HDR 1X3 RA-M  [HDR_1X3RAS]  9.91,83.82 270 top
J25  HDR 1X3 RA-M  [HDR_1X3RAS]  151.38,87.63 90 top
J26  HDR 1X3 RA-M  [HDR_1X3RAS]  68.58,117.09 180 top
J27  HDR 1X3 RA-M  [HDR_1X3RAS]  80.01,117.09 180 top
J28  HDR 1X3 RA-M  [HDR_1X3RAS]  9.91,72.39 270 top
J29  HDR 1X3 RA-M  [HDR_1X3RAS]  151.38,76.2 90 top
J30  HDR 1x3 ST-M  [HDR_1X3]  107.44,106.55 0 top
J31  HDR 2X3 RA-M  [HDR_2X3M_RAS]  105.41,117.09 0 top
J32  HDR 1x3 ST-M  [HDR_1X3]  111.76,17.78 90 top
J33  HDR 2X3 RA-M  [HDR_2X3M_RAS]  100.33,9.91 180 top
J34  HDR 1x3 ST-M  [HDR_1X3]  94.49,21.84 270 top
J35  JACK 3.5mm  [AUDIO-JACK-SJ1-3533NS]  39.37,1.57 90 top
J36  HDR 1X4 RA-M  [HDR_1X4RAS]  60.96,9.91 0 top
J37  HDR 1x2 ST-M  [HDR_1X2]  78.74,12.95 180 top
J38  HDR 1X2 RA-M  [HDR_1X2RAS]  81.28,9.91 0 top
J39  HDR 1X3 RA-M  [HDR_1X3RAS]  72.39,9.91 0 top
J40  HDR 1x3 ST-M  [HDR_1X3]  102.87,17.78 90 top
J41  HDR 2x5 RA-M  [HDR_2X5M-RAHDR]  5.08,26.42 90 top
J42  HDR 2x4 RA-M  [HDR_2X4M-RAHDR]  5.08,9.14 90 top
L1  10uH  [IND_5X5MM-5045]  134.49,100.84 90 top
LP1  25.4X3mm  [EXTERNAL]  -7.62,-6.86 0 top  (outside the outline)
LP2  25.4X3mm  [EXTERNAL]  -4.83,-6.6 0 top  (outside the outline)
M1  Teensy 3.6  [TEENSY_3.6_ALL_PINS&PADS]  30.48,58.42 270 top
M2  ARD. MEGA  [ARDUINO_MEGA_ICSP]  15.24,38.1 0 top
MK1  MIC  [SPH6611_MEMS_2.65X3.50]  9.45,7.62 90 top
Q1  FDWS9509L  [FDN8_5.1X6.3]  153.92,95.25 270 top
Q2  DMG4822  [SOIC8-127P60]  19.68,87 180 top
Q3  DMG4822  [SOIC8-127P60]  141.35,84.84 0 top
Q4  DMG4822  [SOIC8-127P60]  19.68,75.18 180 top
Q5  DMG4822  [SOIC8-127P60]  141.48,73.03 0 top
R1  20 Ω  [R0603]  57.15,69.09 270 top
R2  20 Ω  [R0603]  54.61,69.09 270 top
R3  20 Ω  [R0603]  52.07,69.09 270 top
R4  20 Ω  [R0603]  49.53,69.09 270 top
R5  20 Ω  [R0603]  46.99,69.09 270 top
R6  20 Ω  [R0603]  44.45,69.09 270 top
R7  20 Ω  [R0603]  41.91,69.09 270 top
R8  20 Ω  [R0603]  39.37,69.09 270 top
R9  20 Ω  [R0603]  36.83,69.22 270 top
R10  20 Ω  [R0603]  34.29,69.22 270 top
R11  20 Ω  [R0603]  31.75,69.22 270 top
R12  20 Ω  [R0603]  29.21,69.22 270 top
R13  20 Ω  [R0603]  26.67,69.22 270 top
R14  20 Ω  [R0603]  27.69,52.83 180 top
R15  56 kΩ  [R0603]  132.08,93.73 90 top
R16  100 kΩ  [R0603]  147.32,91.95 180 top
R17  10 kΩ  [R0603]  134.82,93.73 90 top
R18  470 kΩ  [R0603]  147.17,29.72 90 top
R19  10 kΩ  [R0603]  140.41,104.11 180 top
R20  2.2 kΩ  [R0603]  117.73,113.67 270 top
R21  2.2 kΩ  [R0603]  123.06,113.67 270 top
R22  2.2 kΩ  [R0603]  124.84,113.67 270 top
R23  300 kΩ  [R0603]  137.54,113.54 270 top
R24  4.3 kΩ  [R0603]  126.62,113.67 270 top
R25  4.3 kΩ  [R0603]  121.28,113.67 270 top
R26  4.3 kΩ  [R0603]  119.51,113.67 270 top
R27  10 kΩ  [R0603]  137.54,110.49 90 top
R28  10 kΩ  [R0603]  136.75,106.96 0 top
R29  10 kΩ  [R0603]  143.26,104.62 180 top
R30  10 kΩ  [R0603]  131.19,107.59 180 top
R31  0.025 Ohm  [R1206]  141.1,112.52 90 top
R32  2.2 kΩ  [R0603]  124.46,13.97 90 top
R33  2.2 kΩ  [R0603]  118.75,13.97 90 top
R34  2.2 kΩ  [R0603]  116.84,13.97 90 top
R35  10 kΩ  [R0603]  141.48,22.91 90 top
R36  4.3 kΩ  [R0603]  114.94,13.97 90 top
R37  4.3 kΩ  [R0603]  120.65,13.97 90 top
R38  4.3 kΩ  [R0603]  122.56,13.97 90 top
R39  10 kΩ  [R0603]  128.04,40.72 180 top
R40  300 kΩ  [R0603]  138.68,14.17 270 top
R41  10 kΩ  [R0603]  134.57,11.53 0 top
R42  10 kΩ  [R0603]  146.05,21.34 270 top
R43  10 kΩ  [R0603]  139.95,22.91 270 top
R44  10 kΩ  [R0603]  132.59,19.81 180 top
R45  0.025 Ohm  [R1206]  143,15.01 270 top
R46  0 Ω  [R0603]  128.04,42.52 0 top
R47  10 kΩ  [R0603]  128.04,44.3 0 top
R48  10 kΩ  [R0603]  128.09,32.94 0 top
R49  10 kΩ  [R0603]  128.12,34.85 0 top
R50  10 kΩ  [R0603]  128.12,36.75 0 top
R51  10K  [SM-4.5X4.5-TRIM]  134.62,44.96 180 top
R52  0.1 Ohm  [R1210]  145.03,35.56 0 top
R53  0.1 Ohm  [R1210]  145.03,38.86 180 top
R54  10 kΩ  [R0603]  128.02,56.64 180 top
R55  0 Ω  [R0603]  128.02,58.42 0 top
R56  10 kΩ  [R0603]  128.02,60.2 0 top
R57  10 kΩ  [R0603]  128.02,49.02 0 top
R58  10 kΩ  [R0603]  128.02,50.8 0 top
R59  10 kΩ  [R0603]  128.02,52.58 0 top
R60  10K  [SM-4.5X4.5-TRIM]  134.49,61.09 180 top
R61  0.1 Ohm  [R1210]  145.03,51.82 0 top
R62  0.1 Ohm  [R1210]  145.03,54.99 180 top
R63  20 Ω  [R0603]  52.7,98.68 270 top
R64  NP  [R0603]  100.46,104.27 180 top
R65  4.3 kΩ  [R0603]  51.56,106.3 270 top
R66  NP  [R0603]  55.88,102.11 0 top
R67  10 kΩ  [R0603]  49.66,106.3 270 top
R68  0 Ω  [R0603]  55.88,105.92 0 top
R69  0 Ω  [R0603]  55.88,104.14 0 top
R70  NP  [R0603]  42.42,97.66 90 top
R71  NP  [R0603]  44.2,97.66 90 top
R72  0 Ω  [R0603]  45.97,97.66 90 top
R73  NP  [R0603]  47.75,97.66 90 top
R74  2.2 kΩ  [R0603]  38.86,97.16 180 top
R75  3.3 kΩ  [R0603]  26.04,97.41 0 top
R76  10 kΩ  [R0603]  26.04,99.19 180 top
R77  NP  [R0603]  38.86,95.38 180 top
R78  NP  [R0603]  34.67,110.36 180 top
R79  1K  [PV36YTRIMMER]  41.78,112.01 90 top
R80  NP  [R0603]  49.02,110.24 0 top
R81  51 Ω  [R0603]  38.48,107.82 180 top
R82  1K  [PV36YTRIMMER]  34.29,102.87 180 top
R83  NP  [R0603]  41.27,107.82 180 top
R84  20 Ω  [R0603]  81.41,98.17 270 top
R85  3.3 kΩ  [R0603]  26.8,112.9 0 top
R86  10 kΩ  [R0603]  26.8,111.12 180 top
R87  15 kΩ  [R0603]  81.66,105.66 270 top
R88  NP  [R0603]  84.84,99.57 0 top
R89  10 kΩ  [R0603]  79.88,105.66 270 top
R90  NP  [R0603]  84.84,101.47 0 top
R91  NP  [R0603]  84.84,103.25 0 top
R92  NP  [R0603]  71.63,98.04 90 top
R93  NP  [R0603]  73.41,98.04 90 top
R94  0 Ω  [R0603]  75.18,98.04 90 top
R95  NP  [R0603]  76.96,98.04 90 top
R96  2.2 kΩ  [R0603]  68.96,98.3 180 top
R97  NP  [R0603]  65.91,98.3 0 top
R98  NP  [R0603]  52.2,110.24 180 top
R99  1K  [PV36YTRIMMER]  59.18,112.01 90 top
R100  NP  [R0603]  68.07,111.25 0 top
R101  51 Ω  [R0603]  68.07,108.33 180 top
R102  1K  [PV36YTRIMMER]  63.75,104.14 180 top
R103  NP  [R0603]  59.56,108.08 180 top
R104  1.0 kΩ  [R0603]  19.56,14.1 90 top
R105  1.0 kΩ  [R0603]  21.72,14.1 90 top
R106  1.0 kΩ  [R0603]  24,14.1 90 top
R107  10 kΩ  [R0603]  76.2,108.97 180 top
R108  10 kΩ  [R0603]  76.2,110.74 180 top
R109  10 kΩ  [R0603]  76.2,112.52 180 top
R110  10 kΩ  [R0603]  76.2,114.3 180 top
R111  1.0 kΩ  [R0603]  88.14,108.97 0 top
R112  1.0 kΩ  [R0603]  88.14,110.74 0 top
R113  1.0 kΩ  [R0603]  88.14,112.52 0 top
R114  1.0 kΩ  [R0603]  88.14,114.3 0 top
R115  10 kΩ  [R0603]  99.57,108.58 180 top
R116  10 kΩ  [R0603]  99.57,110.49 180 top
R117  10 kΩ  [R0603]  99.57,112.45 180 top
R118  10 kΩ  [R0603]  99.57,114.43 180 top
R119  10 kΩ  [R0603]  111.25,108.97 0 top
R120  10 kΩ  [R0603]  111.25,110.74 0 top
R121  10 kΩ  [R0603]  111.25,112.52 0 top
R122  10 kΩ  [R0603]  111.25,114.3 0 top
R123  360 Ω  [R0603]  32.38,93.47 180 top
R124  360 Ω  [R0603]  20.95,45.97 180 top
R125  100 Ω  [R0603]  20.98,41.83 180 top
R126  100 Ω  [R0603]  20.93,43.97 180 top
R127  1K  [SM-4.5X4.5-TRIM]  89.92,2.79 0 top
R128  10 kΩ  [R0603]  3.81,40.13 180 top
R129  SHUNT  [R0603-SHORT]  111.25,98.96 0 bottom
R130  0 Ω  [R0603]  35.43,33.02 270 top
R131  10 kΩ  [R0603]  36.04,28.88 180 top
R132  10 kΩ  [R0603]  36.07,27.05 0 top
R133  NP  [R0603]  57.78,28.96 180 top
R134  10K  [RK09-ALPS-VERT-POT]  16.51,102.87 270 top
R135  300 kΩ  [R0603]  39.37,31.62 0 top
R136  4.3 kΩ  [R0603]  39.37,33.4 0 top
R137  200K  [SM-4.5X4.5-TRIM]  39.75,20.57 90 top
R138  100 Ω  [R0603]  30.35,4.95 180 top
R139  NP  [R0603]  64.14,28.96 180 top
R140  10 kΩ  [R0603]  39.75,16.13 90 top
R141  0 Ω  [R0603]  45.97,22.23 180 top
R142  0 Ω  [R0603]  45.97,20.57 180 top
R143  2.2 kΩ  [R0603]  46.79,10.19 90 top
R144  20 Ω  [R0603]  57.91,21.56 270 top
R145  20 Ω  [R0603]  49,19.35 90 top
R146  SHUNT  [R0603-SHORT]  78.74,15.9 270 top
R147  0 Ω  [R0603]  53.09,30.48 270 top
R148  15 kΩ  [R0603]  77.98,19.18 270 top
R149  10 kΩ  [R0603]  69.09,18.8 0 top
R150  10 kΩ  [R0603]  69.09,20.45 0 top
R151  SHUNT  [R0603-SHORT]  55.88,23.11 270 top
R152  SHUNT  [R0603-SHORT]  45.85,26.54 0 top
R153  SHUNT  [R0603-SHORT]  81.79,23.11 270 top
R154  SHUNT  [R0603-SHORT]  45.85,24.89 0 top
R155  0 Ω  [R0603]  9.14,4.32 0 top
R156  100 Ω  [R0603]  62.23,17.02 0 top
R157  100 Ω  [R0603]  62.23,15.24 0 top
R158  SHUNT  [R0603-SHORT]  111.25,100.46 0 bottom
R159  SHUNT  [R0603-SHORT]  111.25,101.96 0 bottom
R160  SHUNT  [R0603-SHORT]  111.25,103.45 0 bottom
R161  20 Ω  [R0603]  6.73,99.31 270 top
R162  10 kΩ  [R0603]  17.53,111.51 0 top
R163  SHUNT  [R0603-SHORT]  29.72,28.96 90 top
R164  SHUNT  [R0603-SHORT]  21.08,27.43 180 top
R165  15 kΩ  [R0603]  76.3,19.2 270 top
R166  2.2 kΩ  [R0603]  46.99,5.33 90 top
SPK1  CMI-9650C-120  [BUZZER-5MM-12.4D]  90.48,11.67 315 top
SPK2  1W  [EXTERNAL]  -9.91,-6.86 0 top  (outside the outline)
SW1  SPST  [SWITCH_TAC_6MM]  9.65,114.55 270 top
SW2  SPST  [SWITCH_TAC_6MM]  12.7,15.24 0 top
SW3  SPST  [SWITCH_TAC_6MM]  12.7,27.94 0 top
SW4  SPST  [SWITCH_TAC_6MM]  12.7,45.72 0 top
TP1  !HOME-R  [SMT_TEST]  130.56,48.51 180 top
TP2  !EN-R  [SMT_TEST]  130.56,53.34 180 top
TP3  DECAY-R  [SMT_TEST]  130.56,54.99 180 top
TP4  !HOME-R  [SMT_TEST]  130.56,32.38 180 top
TP5  !EN-R  [SMT_TEST]  130.56,37.21 180 top
TP6  DECAY-R  [SMT_TEST]  130.56,38.99 180 top
U$1  [3,0]  153.67,7.62 0 top
U$2  [3,0]  153.67,119.38 0 top
U$3  FIDUCIAL  [FIDUCIAL_1MM]  30.73,2.54 0 top
U$4  [3,0]  5.08,105.41 0 top
U$5  [3,0]  68.58,66.04 0 top
U$6  FIDUCIAL  [FIDUCIAL_1MM]  134.37,121.16 0 top
U$7  [3,0]  5.08,21.59 0 top

## Tracks (layer width: path | path; a pad name or v marks a point on that pad's centre or on a via)
1
  Top 0.305: R114.1 87.04,113.92 86.87,113.92 86.36,113.41 86.36,113.16 86.11,112.9 85.14,112.9 IC15.13 84.04,112.93 83.82,113.16 83.82,114.05 84.07,114.3 84.96,114.3 87.12,116.46 87.12,118.62 86.23,119.51 71.25,119.51 69.85,118.11 69.85,116.33 70.61,115.57 72.39,115.57
  Top 0.406: J26.3 73.66,116.84 72.97,116.15 | 72.39,115.57 72.97,116.15 | 72.97,116.15 73.88,116.45 J26.3 | 72.97,116.15 72.99,117.11 J26.3
2
  Top 0.254: IC15.12 85.09,112.27
  Top 0.305: R113.1 86.61,112.52 86.36,112.27 85.09,112.27 | IC15.12 83.81,112.28 83.19,112.9 83.19,114.3 83.9,115.01 84.88,115.01 86.49,116.62 86.49,118.24 85.98,118.75 71.75,118.75 71.27,118.25 | 71.27,118.25 71.12,118.11 | 71.27,118.25 70.61,117.61 J26.2 71.74,117.47 71.27,118.25
  Top 0.406: 71.12,118.11 J26.2
3
  Top 0.305: 102.11,118.36 103.58,118.36 | 104.13,118.91 104.13,120.15
  Top 0.406: R122.1 109.29,113.06 IC16.13 108.33,113.08 107.34,113.08 106.93,113.49 106.93,114.71 107.64,115.42 107.64,119.48 106.12,121.01 104.85,121.01 104.06,120.22 104.13,120.15 | J31.1 100.84,117.09 102.11,118.36 | 103.58,118.36 104.13,118.91
4
  Top 0.305: 106.32,118.36 104.7,118.36
  Top 0.406: R121.1 110.42,112.41 IC16.12 108.33,112.43 106.93,112.43 106.12,113.23 106.12,115.42 106.88,116.18 106.88,117.81 106.32,118.36 | 104.7,118.36 103.95,117.62 | 103.95,117.62 103.43,117.09 J31.3 | 103.95,117.62 102.99,117.78 J31.3 | 103.95,117.62 103.48,116.76 J31.3
54  (via drill 0.35, 0.4)
  Top 0.203: IC18.2 98.8,26.09 | 34.54,53.59 34.54,52.58 35.36,51.77 35.36,48.49 35.13,48.26
  Top 0.254: M1.54 34.54,53.59 | 35.13,48.26 35.13,36.25 v35.31,36.07
  Top 0.305: 98.8,26.09 91.07,33.82 | 91.07,33.82 90.7,34.19 v90.7,34.29 | 91.07,33.82 90.95,34.35 v90.7,34.29 | 91.07,33.82 90.59,34.07 v90.7,34.29
  Bottom 0.203: 90.25,34.69 90.01,34.92 77.85,34.92 76.96,35.81 64.77,35.81 64.14,36.45 36.45,36.45 36.07,36.07 | 90.25,34.69 90.65,34.29 v90.7,34.29 | 90.25,34.69 90.42,34.19 v90.7,34.29 | 90.25,34.69 90.76,34.59 v90.7,34.29
  Bottom 0.254: v35.31,36.07 36.07,36.07
55  (via drill 0.3, 0.4)
  Top 0.203: IC18.3 98.3,23.11 | 75.24,37.15 74.95,37.45 74.95,45.66 66.42,54.2 65.45,54.2 | 75.24,37.15 v75.56,36.83 | v64.99,54.2 65.45,54.2 | 75.24,37.15 75.32,36.78 v75.56,36.83 | 75.24,37.15 75.61,37.08 v75.56,36.83 | 65.45,54.2 65.13,54.41 v64.99,54.2 | 65.45,54.2 65.13,53.99 v64.99,54.2
  Top 0.305: v89.46,35.69 89.43,35.69 89.43,35.09 | 89.43,35.09 89.43,31.98 98.3,23.11 | 89.43,35.09 89.68,35.57 v89.46,35.69 | 89.43,35.09 89.23,35.59 v89.46,35.69
  Bottom 0.203: M1.55 39.37,54.91 39.37,54.59 40.47,53.49 45.07,53.49 46.01,54.43 64.6,54.43 | 89.01,36.09 88.27,36.83 76.02,36.83 | 89.01,36.09 89.38,35.72 v89.46,35.69 | v75.56,36.83 76.02,36.83 | v64.99,54.2 64.76,54.43 64.6,54.43 | 89.01,36.09 89.17,35.59 v89.46,35.69 | 89.01,36.09 89.52,35.98 v89.46,35.69 | 76.02,36.83 75.71,37.04 v75.56,36.83 | 76.02,36.83 75.71,36.62 v75.56,36.83 | 64.6,54.43 64.76,54.09 v64.99,54.2 | 64.6,54.43 64.98,54.45 v64.99,54.2
  Bottom 0.406: 39.37,54.91 39.81,55.59 M1.55 38.92,55.59 39.37,54.91
+3.3V  (via drill 0.3, 0.35, 0.4, 0.45, 0.5, 0.55, 0.6, 0.65, 0.8)
  Top 0.203: R154.P$1 45.4,24.92 45.24,24.92 R154.1 | R152.1 45.24,26.51 R152.P$1 | IC18.1 99.57,20.89 | IC17.1 107.85,20.62 | C62.2 22.42,26.02 IC24.12 | IC24.18 25.91,22.1 v25.4,21.59 | IC24.4 25.91,29.54 25.32,30.12 v25.55,30.12
  Top 0.254: R35.2 142.29,23.63 | 142.29,23.63 142.69,23.63 142.7,23.62 v142.75,23.62 | 142.29,23.63 142.63,23.43 v142.75,23.62 | 142.29,23.63 142.64,23.82 v142.75,23.62 | R128.2 v2.03,40.13
  Top 0.305: R39.2 126.53,39.93 | 126.53,39.93 v126.11,39.51 v126.11,39.5 | R54.2 126.62,55.96 | 126.62,55.96 126.24,55.58 v126.24,55.5 | 126.53,39.93 126.02,39.73 v126.11,39.5 | 126.53,39.93 126.35,39.41 v126.11,39.5 | 126.62,55.96 126.13,55.72 v126.24,55.5 | 126.62,55.96 126.48,55.44 v126.24,55.5 | 99.57,20.89 99.57,21.21 | 107.85,20.62 107.87,20.65 | C62.2 21.92,25.28 v21.92,24.25 21.92,23.93
  Top 0.406: IC4.8 135.68,115.08 135.54,115.22 | C12.2 135.54,115.22 | 135.54,115.22 135.78,115.22 | 135.78,115.22 136.1,115.22 136.4,115.52 v136.37,115.55 | R19.2 139.14,104.11 | 139.14,104.11 138.86,104.11 138.58,103.83 v138.66,103.76 | IC6.8 136.86,15.24 C15.2 137.09,16.53 | 137.09,16.53 137.22,16.41 138.02,16.41 138.07,16.36 v138.05,16.33 | IC16.1 103.66,113.71 103.99,113.39 103.99,112.34 106.52,109.81 IC16.8 108.35,108.19 109.26,107.27 | 109.26,107.27 J30.3 | R118.2 98.42,114.43 97.58,115.27 | 97.58,115.27 v97.16,115.7 | R117.2 96.44,112.45 94.49,110.49 94.49,107.57 | 94.49,107.57 J21.3 | R115.2 97.92,107.65 97.92,107.28 | 97.92,107.28 v97.92,106.68 | R116.2 98.59,110.24 98.25,110.24 | 98.25,110.24 97.66,110.24 v97.66,110.37 | 82.67,110.62 81.41,111.89 81.41,112.9 80.73,113.58 IC15.1 78.98,113.58 78.72,113.84 78.72,114.57 77.85,115.44 77.19,115.44 | 82.67,110.62 82.8,110.49 | 82.8,110.49 83.61,109.68 83.7,109.68 | 83.7,109.68 IC15.8 | 82.8,110.49 v82.8,109.73 | R107.2 R108.2 R109.2 R110.2 75.48,114.85 75.69,115.06 | 75.69,115.06 v76.33,115.7 | v76.33,115.7 76.58,115.44 77.19,115.44 | C36.2 79.88,97.45 R84.2 81.41,96.95 | 81.41,96.95 81.41,96.52 v81.79,96.14 | C28.2 52.54,97.79 R63.2 52.7,97.28 52.83,97.16 | 52.83,97.16 v53.47,96.52 | D15.2 19.39,114.3 20.83,112.86 v20.83,111.51 R162.2 | D14.1 13.52,38.99 15.62,38.99 15.79,39.16 | 15.79,39.16 16.2,39.57 v16.2,39.73 | R145.1 48.55,18.64 | 48.55,18.64 47.82,18.64 v47.8,18.62 | R144.1 58.9,22.29 | 58.9,22.29 59.22,22.29 v59.56,22.63 | 135.78,115.22 136.41,115.32 v136.37,115.55 | 135.78,115.22 136.21,115.69 v136.37,115.55 | 139.14,104.11 138.6,103.95 v138.66,103.76
  Top 0.406: 139.14,104.11 138.82,103.65 v138.66,103.76 | 137.09,16.53 137.88,16.05 v138.05,16.33 | 137.09,16.53 138.01,16.65 v138.05,16.33 | 97.58,115.27 97.33,115.78 v97.16,115.7 | 97.58,115.27 97.07,115.52 v97.16,115.7 | 97.92,107.28 97.73,106.75 v97.92,106.68 | 97.92,107.28 98.11,106.75 v97.92,106.68 | 98.25,110.24 97.77,110.54 v97.66,110.37 | 98.25,110.24 97.69,110.17 v97.66,110.37 | 82.67,110.62 82.51,109.79 v82.8,109.73 | 82.67,110.62 83.07,109.87 v82.8,109.73 | 83.7,109.68 82.92,110 v82.8,109.73 | 83.7,109.68 82.89,109.44 v82.8,109.73 | 75.69,115.06 76.46,115.43 v76.33,115.7 | 75.69,115.06 76.06,115.83 v76.33,115.7 | 77.19,115.44 76.5,115.94 v76.33,115.7 | 77.19,115.44 76.34,115.4 v76.33,115.7 | 81.41,96.95 81.49,96.11 v81.79,96.14 | 81.41,96.95 82,96.35 v81.79,96.14 | 52.83,97.16 53.2,96.39 v53.47,96.52 | 52.83,97.16 53.6,96.79 v53.47,96.52 | 15.79,39.16 16.34,39.51 v16.2,39.73 | 15.79,39.16 16.01,39.79 v16.2,39.73 | 48.55,18.64 47.88,18.86 v47.8,18.62 | 48.55,18.64 47.89,18.38 v47.8,18.62 | 58.9,22.29 59.6,22.38 v59.56,22.63 | 58.9,22.29 59.38,22.8 v59.56,22.63 | 109.26,107.27 109.36,106.47 J30.3 | 109.26,107.27 110.06,107.17 J30.3 | 94.49,107.57 94,106.93 J21.3 | 94.49,107.57 94.98,106.93 J21.3 | R152.P$1 45.13,26.2 R154.1 | 107.87,20.65 110.24,20.65 | 110.24,20.65 111.43,20.65 J32.3 | C63.2 110.24,21.8 110.24,20.65 | R130.1 35.22,33.53 34.8,33.53 34.14,32.87 v34.14,32.28
  Top 0.508: v3.37,99 3.79,99.42 | 3.79,99.42 4.32,99.95 6.65,99.95 R161.1 | 3.79,99.42 3.29,99.12 v3.37,99 | 3.79,99.42 3.49,98.92 v3.37,99 | R155.2 v10.92,4.32 | R154.1 45.13,24.21 v45.47,23.88
  Top 0.61: 102.15,21.04 101.98,21.21 99.57,21.21 | 102.15,21.04 J40.3 | 102.15,21.04 102.36,20.19 J40.3 | 102.15,21.04 103,20.82 J40.3
  Top 0.813: C66.2 91.14,115.53 v90.93,115.32
  pour Route15 (isolate 0.254, rank 2): 0.76,9.78 0.76,117.6 6.35,123.19 139.7,123.19 152.4,110.49 152.4,16.89 136.14,0.64 9.91,0.64
+5V  (via drill 0.35, 0.5, 0.65, 1)
  Top 0.254: R146.2 R146.P$2
  Top 0.406: C64.2 111.25,15.75 J32.1 | R166.1 46.19,4.61 45.47,5.33 v45.47,7.11
  Top 0.508: D1.1 67.61,50.8 | 67.61,50.8 v68.58,50.8 | v79.78,15.24 79.77,15.18 R146.2 | 67.61,50.8 68.5,50.54 v68.58,50.8 | 67.61,50.8 68.5,51.06 v68.58,50.8 | R166.1 46.99,3.81 46.74,3.56 46.74,2.84 C68.2
  Top 0.61: C10.2 147.38,28.79 R18.1 | R18.1 147.45,28.72 IC2.5 | v145.47,29.03 145.49,29.06 145.55,29 146.44,29 | R18.1 146.44,29 | v145.47,29.03 144.78,29.72 | 144.78,29.72 144.74,29.75 | 144.74,29.75 144.09,30.4 v144.02,30.4 | 146.44,29 145.53,29.25 v145.47,29.03 | 146.44,29 145.51,28.81 v145.47,29.03 | 144.78,29.72 145.28,28.91 v145.47,29.03 | 144.78,29.72 145.58,29.22 v145.47,29.03 | 144.74,29.75 144.2,30.53 v144.02,30.4 | 144.74,29.75 143.91,30.21 v144.02,30.4
  Top 0.813: C65.2 89.67,106.29 J21.1
  Top 1.016: v126.62,98.42 126.66,98.38 D2.1 129.03,97.75 v129.03,96.39
  pour Route15: 130.81,99.06 133.35,96.52 133.35,46.99 140.97,39.37 140.97,36.83 145.67,32.13 145.67,28.7 142.75,28.7 142.24,29.21 132.08,29.21 128.27,25.4 128.27,6.35 127,5.08 97.79,5.08 93.98,8.89 74.93,8.89 72.39,6.35 43.69,6.35 44.96,7.62 69.09,7.62 80.52,19.05 113.03,19.05 114.3,20.32 114.3,34.29 118.11,38.1 127,38.1 128.27,39.37 124.46,43.18 124.46,53.34 125.73,54.61 127,54.61 127,55.88 113.03,69.85 92.71,69.85 85.09,62.23 85.09,58.42 66.04,39.37 53.34,39.37 52.07,40.64 52.07,41.91 49.53,41.91 46.99,39.37 44.45,39.37 41.91,41.91 41.91,45.72 44.45,48.26 57.15,48.26 58.42,49.53 58.42,53.34 93.6,88.52 93.6,102.23 93.22,102.62 88.27,102.62 87.63,103.25 87.63,107.95 90.81,107.95 95.76,102.36 101.09,102.36 102.87,104.14 102.87,106.68 104.14,107.95 106.68,107.95 109.22,105.41 111.76,105.41 114.17,107.82 114.17,119.63 114.94,120.4 117.09,120.4 130.81,106.68
+12V  (via drill 0.5, 0.6)
  Top 0.203: 46.67,104.27 46.67,104.3 v46.58,104.19
  Top 0.305: 25.67,107.58 IC11.8
  Top 0.406: 76.62,106.38 C38.2 | 76.62,106.38 IC14.1 76.33,105.49 76.24,105.4 | IC14.2 75.35,106.38 76.62,106.38 | 76.24,105.4 75.67,104.83 v75.67,104.7 | IC12.1 IC12.2 | IC12.1 47.54,105.71 C32.2 | IC12.1 47.24,104.8 | 47.24,104.8 47.24,104.65 46.86,104.27 46.67,104.27 46.61,104.27 | C58.2 29.21,105.42 | 29.21,105.42 v29.21,106.17 | 76.24,105.4 75.51,104.95 v75.67,104.7 | 76.24,105.4 75.95,104.6 v75.67,104.7 | 47.24,104.8 46.47,104.47 v46.58,104.19 46.85,104.05 47.24,104.8 | 29.21,105.42 29.45,106.09 v29.21,106.17 | 29.21,105.42 28.97,106.09 v29.21,106.17
  Top 0.508: v29.21,106.17 28.46,106.17 | 28.46,106.17 26.04,106.17 25.67,106.54 25.67,107.58 | 28.46,106.17 29.16,105.98 v29.21,106.17 | 28.46,106.17 29.16,106.36 v29.21,106.17
  Top 0.61: R64.2 99.52,104.27 IC9.1 97.53,102.45 C31.2 C29.1 92.77,102.45 92.36,102.04 | 92.36,102.04 91.99,101.67 v91.99,101.22 | 92.36,102.04 91.83,101.34 v91.99,101.22 | 92.36,102.04 92.19,101.18 v91.99,101.22
  other vias: 91.99,100.08
  pour Route15: 29.21,110.49 26.67,107.95 26.67,101.6 29.21,99.06 92.71,99.06 92.71,101.6 87.63,101.6 78.74,110.49
+VIINDIR1  (via drill 0.6)
  Top 0.406: R80.1 43.31,110.24 43.05,109.98 | 43.05,109.98 v42.42,109.35 | v40.39,104.14 40.89,104.65 40.89,104.88 | 40.89,104.88 IC12.6 | 43.05,109.98 42.29,109.62 v42.42,109.35 | 43.05,109.98 42.69,109.22 v42.42,109.35 | 40.89,104.88 40.21,104.38 v40.39,104.14 | 40.89,104.88 40.68,104.06 v40.39,104.14
  Bottom 0.406: R79.2 42.31,111.27 | 42.31,111.27 43.8,112.76 | 43.8,112.76 R79.1 | R79.2 42.29,110.24 | 42.29,110.24 42.31,110.22 | 42.31,110.22 42.42,110.11 v42.42,109.35 | v42.42,109.35 41.78,108.71 | 41.78,108.71 40.51,107.44 40.51,105.03 | 40.51,105.03 40.51,104.14 v40.39,104.14 | 42.29,110.24 42.12,109.41 v42.42,109.35 | 42.29,110.24 42.68,109.49 v42.42,109.35 | 41.78,108.71 42.55,109.08 v42.42,109.35 | 41.78,108.71 42.15,109.48 v42.42,109.35 | 40.51,105.03 40.12,104.28 v40.39,104.14 | 40.51,105.03 40.68,104.2 v40.39,104.14 | 43.8,112.76 44.4,112.87 R79.1 | 43.8,112.76 43.91,113.36 R79.1 | 42.31,111.27 41.71,111.16 R79.2 | 42.31,111.27 42.2,110.67 R79.2 | 42.31,110.22 42.2,110.82 R79.2 | 42.31,110.22 41.71,110.33 R79.2
+VIINDIR2  (via drill 0.6)
  Top 0.406: v66.04,111.25 66.94,111.25 | 66.94,111.25 R100.1 67.35,110.58 68.2,109.73 69.22,109.73 69.98,108.97 IC14.6 | 66.94,111.25 66.14,111.53 v66.04,111.25 | 66.94,111.25 66.14,110.97 v66.04,111.25
  Bottom 0.406: R99.2 59.7,111.27 | 59.7,111.27 61.2,112.76 | 61.2,112.76 R99.1 | v66.04,111.25 65.4,111.89 | 65.4,111.89 64.01,113.28 62.46,113.28 | R99.1 62.46,113.28 | 65.4,111.89 65.77,111.12 v66.04,111.25 | 65.4,111.89 66.17,111.52 v66.04,111.25 | 61.2,112.76 61.8,112.87 R99.1 | 61.2,112.76 61.31,113.36 R99.1 | 62.46,113.28 61.96,113.63 R99.1 | 62.46,113.28 61.96,112.94 R99.1 | 59.7,111.27 59.11,111.16 R99.2 | 59.7,111.27 59.6,110.67 R99.2
+VIN1
  Bottom 0.406: J15.3 39.37,115.92 | 39.37,115.92 39.37,114.01 | 39.37,114.01 39.37,113.41 R79.3 | 39.37,114.01 38.94,113.58 R79.3 | 39.37,114.01 39.62,113.46 R79.3 | 39.37,115.92 39.92,116.7 J15.3 | 39.37,115.92 38.82,116.7 J15.3
+VIN2
  Bottom 0.406: J17.3 53.34,115.92 | 53.34,115.92 53.34,115.57 55.63,113.28 55.9,113.28 | 55.9,113.28 R99.3 | 55.9,113.28 56.4,112.94 R99.3 | 55.9,113.28 56.4,113.63 R99.3 | 53.34,115.92 53.89,116.7 J17.3 | 53.34,115.92 52.79,116.7 J17.3
+VPWR  (via drill 0.45, 1)
  Top 0.203: 137.6,108.43 137.41,108.43 137,108.43 137,108.58 v136.96,108.64 | 137.6,108.43 137.2,108.86 v136.96,108.64 | 137.6,108.43 137.02,108.31 v136.96,108.64
  Top 0.254: IC9.5 106.68,98.55 107.06,98.93 107.06,101.73 106.34,102.45 C30.2
  Top 0.305: C11.2 144.31,108.33 IC3.10 | IC3.3 138.18,108.33 138.08,108.33 137.51,108.33 137.41,108.43 | IC5.3 145.81,19.31 | 145.81,19.31 146.66,19.31 147.19,18.77 v147.19,18.72 | IC5.10 139.39,19.31 | 139.39,19.31 139.36,19.31 C14.2 | 145.81,19.31 146.76,18.31 v147.19,18.72 | 145.81,19.31 147.19,19.32 v147.19,18.72 | 139.39,19.31 138.54,18.22 v139.01,17.86 139.6,17.95 139.39,19.31
  Top 0.61: Q1.2 148.97,95.89 | 148.97,95.89 148.72,95.89 148.21,96.39 148.21,97.13 D3.2 | D3.2 148.34,97.85 | 148.34,97.85 148.34,98.02 147.82,98.53 | 147.82,98.53 147.7,98.65 147.7,98.81 v147.45,99.06 | 149.48,97.16 Q1.1 Q1.3 150.24,94.61 148.97,95.89 | 149.48,97.16 148.44,97.16 D3.2 | v149.22,99.06 149.48,99.06 149.48,97.58 | 149.48,97.58 149.48,97.16 | C30.2 105.33,102.36 IC9.8 103.04,102.4 R64.1 101.18,105.2 101.13,105.25 | 101.13,105.25 100.2,106.17 v99.95,106.17 | 148.34,97.85 149.49,98.7 v149.22,99.06 | 148.34,97.85 148.8,99.21 v149.22,99.06 | 147.82,98.53 149.25,98.62 v149.22,99.06 | 147.82,98.53 148.95,99.41 v149.22,99.06 | 149.48,97.58 149.67,99 v149.22,99.06 | 149.48,97.58 148.83,98.86 v149.22,99.06 | 148.34,97.85 147.87,99.21 v147.45,99.06 | 148.34,97.85 147.18,98.7 v147.45,99.06 | 101.13,105.25 100.31,106.42 v99.95,106.17 | 101.13,105.25 99.79,105.76 v99.95,106.17 | C61.1 137.4,19.47 v139.01,17.86
  Top 1.016: C11.2 145.92,109.94 v145.92,110.36 147.07,111.51 C60.1 | C14.2 139.01,18.96 v139.01,17.86 | D16.1 135.55,91.35 136.11,91.92 v137.22,91.92
  other vias: 144.78,95.5 142.88,92.33 94.87,118.87 97.41,118.87
  pour Top (no thermals): 137.16,93.98 137.16,93.22 136.27,92.33 136.27,90.93 138.68,90.93 138.81,91.06 138.81,95.25 136.4,95.25 136.4,95 137.16,94.23
  pour Top: 138.43,94.74 138.43,90.93 143.26,90.93 147.7,95.38 149.1,95.38 149.86,96.14 149.86,98.55 149.61,98.81 147.07,98.81 142.75,94.49 141.1,94.49 140.46,95.12 138.81,95.12
  pour Top: 145.8,19.3 147.52,19.3 147.83,19 147.83,18.44 147.47,18.08 147.02,18.08
  pour Route15: 1.27,110.49 7.62,110.49 10.16,107.95 10.16,92.71 10.54,92.33 17.78,92.33 17.78,114.3 21.59,118.11 105.41,118.11 110.36,123.06 132.72,123.06 136.91,118.87 136.91,108.08 142.49,102.49 142.49,91.82 146.81,87.5 146.81,84.07 142.24,79.5 142.24,78.11 147.45,72.9 147.45,66.04 144.78,63.37 144.78,47.24 152.02,40.01 152.02,25.27 147.19,20.45 138.43,20.45 138.43,0.89 152.15,0.89 160.02,8.76 160.02,118.11 151.89,126.24 151.89,126.36 9.53,126.36 0.76,117.6 0.76,111
  pour Bottom: 93.98,120.65 92.71,119.38 92.71,111.76 99.06,105.41 101.6,105.41 101.6,111.76 99.06,114.3 99.06,119.38 97.79,120.65
-VIN1
  Top 0.406: J15.2 36.83,115.92 | 36.83,115.92 36.83,114.28 33.95,111.4 R78.2 33.95,109.99 34.84,109.11 39.87,109.11 40.55,108.42 R83.2 40.55,107.48 39.62,106.55 IC12.7 | 36.83,115.92 37.38,116.7 J15.2 | 36.83,115.92 36.28,116.7 J15.2
-VIN2
  Top 0.406: J17.2 51.48,116.42 51.48,116.14 | 51.48,116.14 51.48,111.76 | 51.48,111.76 R98.2 | IC14.7 68.71,105.44 66.17,102.89 63.75,102.89 58.8,107.85 58.8,108.03 R103.2 58.29,108.08 54.61,111.76 51.48,111.76 | 51.48,116.14 51.47,117.1 J17.2 | 51.48,116.14 50.58,116.46 J17.2
A0  (via drill 0.3)
  Top 0.203: v61.59,45.09 61.92,44.76 | 61.92,44.76 65.33,41.35 M2.A0 | 61.92,44.76 61.84,45.13 v61.59,45.09 | 61.92,44.76 61.55,44.84 v61.59,45.09
  Top 0.254: R134.2 11.34,102.16 12.7,100.81 12.7,97.79 11.94,97.03 6.6,97.03 4.55,94.97 4.55,75.21 5.08,74.68 5.08,49.02 3.79,47.73 3.79,46.35 4.86,45.28 | M1.14/A0 29.21,49.84 29.21,49.02 v25.15,44.96 | 4.86,45.28 v5.18,44.96 | 4.86,45.28 4.96,44.9 v5.18,44.96 | 4.86,45.28 5.24,45.18 v5.18,44.96
  Top 0.406: 65.33,41.35 65.41,40.58 M2.A0 66.1,41.27 65.33,41.35
  Top 0.508: 29.21,49.84 29.63,50.56 M1.14/A0 28.79,50.56 29.21,49.84 | 11.34,102.16 11.12,103 R134.2 10.51,102.39 11.34,102.16
  Bottom 0.203: v61.59,45.09 61.44,45.24 61.17,45.24 | 61.17,45.24 34.77,45.24 34.61,45.09 25.53,45.09 | 61.17,45.24 61.39,44.94 v61.59,45.09 | 61.17,45.24 61.54,45.33 v61.59,45.09
  Bottom 0.254: v5.18,44.96 5.64,44.96 | 5.64,44.96 24.69,44.96 | 24.69,44.96 25,44.72 v25.15,44.96 | 24.69,44.96 25,45.19 v25.15,44.96 | 5.64,44.96 5.3,45.16 v5.18,44.96 | 5.64,44.96 5.3,44.76 v5.18,44.96 | 25.53,45.09 25.27,45.09 v25.15,44.96
A1  (via drill 0.3, 0.5)
  Top 0.203: v65.25,37.31 65.57,37.63 | 65.57,37.63 67.87,39.93 M2.A1 | 65.57,37.63 65.2,37.55 v65.25,37.31 | 65.57,37.63 65.5,37.26 v65.25,37.31
  Top 0.254: R104.2 19.71,14.82 21.33,16.43 26.07,16.43 32.03,22.39 32.03,34.27 v31.75,34.54 | v31.75,37.08 31.75,37.54 | 31.75,37.54 31.75,49.84 M1.15/A1 | 31.75,37.54 31.55,37.2 v31.75,37.08 | 31.75,37.54 31.95,37.2 v31.75,37.08
  Top 0.406: 67.87,39.93 68.64,40.01 M2.A1 67.95,40.7 67.87,39.93
  Top 0.508: 31.75,49.84 32.17,50.56 M1.15/A1 31.33,50.56 31.75,49.84
  Bottom 0.203: v65.25,37.31 65.09,37.47 64.82,37.47 | 64.82,37.47 32.07,37.47 32.04,37.44 | 32.04,37.44 31.75,37.15 v31.75,37.08 | 32.04,37.44 31.68,37.33 v31.75,37.08 | 32.04,37.44 32,37.06 v31.75,37.08 | 64.82,37.47 65.04,37.16 v65.25,37.31 | 64.82,37.47 65.19,37.55 v65.25,37.31
  Bottom 0.254: 31.75,36.63 v31.75,37.08 | 31.75,36.63 31.95,36.97 v31.75,37.08 | 31.75,36.63 31.55,36.97 v31.75,37.08 | 31.75,36.63 v31.75,34.54
A2  (via drill 0.3)
  Top 0.203: v67.15,36.67 67.47,36.99 | 67.47,36.99 70.41,39.93 M2.A2 | 67.47,36.99 67.1,36.92 v67.15,36.67 | 67.47,36.99 67.4,36.62 v67.15,36.67 | 34.37,37.16 34.24,37.03 v34.24,36.8
  Top 0.254: M1.16/A2 34.29,49.84 | 34.37,37.16 34.37,49.97 | R105.2 22.73,15.83 26.31,15.83 32.66,22.18 32.66,35.2 34.24,36.78 v34.24,36.8
  Top 0.406: 70.41,39.93 71.18,40.01 M2.A2 70.49,40.7 70.41,39.93
  Top 0.508: 34.29,49.84 34.37,49.97 34.71,50.56 M1.16/A2 33.87,50.56 34.29,49.84
  Bottom 0.203: 66.69,36.67 67.07,36.67 | 67.07,36.67 v67.15,36.67 | 66.69,36.67 67.01,36.46 v67.15,36.67 | 67.07,36.67 66.88,36.54 64.83,36.54 64.41,36.92 34.36,36.92 v34.24,36.8 | 66.69,36.67 67.01,36.88 v67.15,36.67
A3  (via drill 0.35, 0.5)
  Top 0.203: 72.95,39.93 M2.A3
  Top 0.254: M1.17/A3 36.83,49.84 36.83,49.28 36.58,49.02 36.58,46.48 36.83,46.23 36.83,41.4 42.52,35.71 v42.52,35.61 | 72.95,39.87 69.85,36.77 v69.85,35.05 | v34.21,35.31 33.2,34.3 33.2,21.93 26.09,14.82 R106.2
  Top 0.406: 72.97,40.15 72.95,39.93 73.72,40.01 M2.A3 73.03,40.7 72.97,40.15 | 72.95,39.87 72.97,40.15
  Top 0.508: 36.83,49.84 37.25,50.56 M1.17/A3 36.41,50.56 36.83,49.84
  Bottom 0.254: v69.85,35.05 64.52,35.05 63.75,35.81 42.72,35.81 v42.52,35.61 36.52,35.61 36.17,35.26 34.21,35.26 v34.21,35.31
A4/SDA  (via drill 0.3, 0.35)
  Top 0.203: 38.73,53.68 38.73,51.59 38.77,51.56 39.37,50.96 M1.18/A4 | v30.96,54.29 31.27,54.61 31.27,54.62 | 31.27,54.62 31.27,63.96 33.18,65.86 33.18,85.57 35.84,88.22 36.51,88.9 M2.SDA | 38.73,53.68 38.96,54.01 v38.81,54.11 38.56,53.94 38.73,53.68 | 31.27,54.62 30.9,54.54 v30.96,54.29 | 31.27,54.62 31.21,54.25 v30.96,54.29 | IC24.24 30.07,26.02 v30.35,25.73
  Top 0.254: 39.37,48.01 41.4,45.97 41.4,38.86 | v44.83,34.52 44.73,34.52 44.02,33.81 44.02,29.57 45.82,27.76 46.8,27.76 47.3,27.26 47.3,26.3 47.83,25.77 IC22.17 | v33.53,119.13 33.2,118.8 | 33.2,118.8 32.87,118.47 32.87,109.04 35.48,106.43 35.48,104.93 34.37,103.81 34.37,102.46 35.26,101.58 35.26,90.22 35.87,89.61 M2.SDA | v76.2,34.54 76.2,35 | 76.25,34.91 76.25,39.71 | 76.2,39.64 M2.A4 | 33.2,118.8 33.59,118.91 v33.53,119.13 | 33.2,118.8 33.31,119.19 v33.53,119.13 | 76.2,35 76,34.66 v76.2,34.54 | 76.2,35 76.25,34.91 | 76.25,34.91 76.4,34.66 v76.2,34.54
  Top 0.305: 80.06,112.28 IC15.3 78.23,112.28 77.85,112.66 77.06,112.66 R109.1 | 80.06,112.28 v80.52,112.28 | 80.06,112.28 80.43,112.1 v80.52,112.28 | 80.06,112.28 80.43,112.47 v80.52,112.28 | v44.83,34.52 44.83,35.43 41.4,38.86
  Top 0.406: M1.18/A4 39.37,49.84 | 39.37,49.84 39.37,48.01 | 39.37,49.84 39.81,50.51 M1.18/A4 | 39.37,49.84 38.92,50.51 M1.18/A4 | M1.18/A4 38.84,50.76 38.77,51.56 39.54,51.31 M1.18/A4 | 35.84,88.22 36.61,88.27 M2.SDA 35.95,88.99 35.84,88.22
  Top 0.508: 76.2,39.64 76.25,39.71 76.67,40.3 M2.A4 75.73,40.3 76.2,39.64 | 35.87,89.61 36,88.81 M2.SDA 36.67,89.48 35.87,89.61
  Bottom 0.203: v38.81,54.11 38.63,54.29 38.31,54.29 | v30.96,54.29 31.41,54.29 | 31.38,54.27 38.33,54.27 | 38.31,54.29 38.33,54.27 | 38.33,54.27 38.57,53.93 v38.81,54.11 | 38.31,54.29 38.74,54.4 v38.81,54.11 | 31.41,54.29 31.1,54.5 v30.96,54.29 | 31.41,54.29 31.38,54.27 | 31.38,54.27 31.1,54.08 v30.96,54.29
  Bottom 0.254: v80.52,112.28 80.06,112.28 | 80.06,112.28 79.49,112.28 79.25,112.52 66.29,112.52 59.69,119.13 33.98,119.13 | 33.98,119.13 v33.53,119.13 | v76.2,34.54 75.95,34.29 75.82,34.29 | 80.06,112.28 80.4,112.08 v80.52,112.28 | 80.06,112.28 80.4,112.48 v80.52,112.28 | 33.98,119.13 33.64,119.32 v33.53,119.13 | 33.98,119.13 33.64,118.93 v33.53,119.13 | 75.82,34.29 76.22,34.32 v76.2,34.54 | 75.82,34.29 75.94,34.54 76,34.65 v76.2,34.54 | 75.82,34.29 45.97,34.29 45.72,34.54 44.86,34.54 v44.83,34.52 34.77,34.52 34.29,34.04 33.02,34.04 30.35,31.37 v30.35,25.73
A5/SCL  (via drill 0.3, 0.5)
  Top 0.203: 42.84,53.87 | 42.84,53.87 42.84,51.89 42.51,51.56 41.91,50.96 M1.19/A5 | 53.03,59.22 54.45,60.64 54.45,64.67 53.5,65.62 53.5,80.98 | 53.01,59.12 v52.76,58.87 | v53.5,81.49 53.5,80.98 | 42.84,53.87 42.97,54.07 42.86,54.07 v42.86,54.32 42.6,54.22 42.84,53.87 | 53.03,59.22 52.7,59.15 v52.76,58.87 | 53.03,59.22 52.95,58.83 v52.76,58.87 | 53.5,80.98 53.73,81.33 v53.5,81.49 | 53.5,80.98 53.26,81.33 v53.5,81.49 | IC24.25 29.72,26.42 31.22,27.92 v31.22,28.07
  Top 0.254: 41.91,49.53 41.91,39.31 | v32.26,120.14 32.23,120.14 32.08,119.99 32.08,119.72 | 32.08,119.72 32.08,108.81 34.7,106.2 34.7,105.21 33.83,104.34 33.83,101.81 34.6,101.04 34.6,89.72 34.6,89.37 34.56,89.42 M2.SCL | v78.74,33.96 78.74,34.42 | 78.74,34.42 78.74,39.64 M2.A5 | 32.08,119.72 32.4,119.96 v32.26,120.14 | 32.08,119.72 32.03,120.11 v32.26,120.14 | 78.74,34.42 78.54,34.07 v78.74,33.96 | 78.74,34.42 78.94,34.07 v78.74,33.96 | IC22.16 47.99,26.27 47.76,26.49 47.76,27.53 46.94,28.35 45.9,28.35 44.58,29.67 44.58,33.25 v44.86,33.53 45.11,33.53 45.66,34.08 45.66,35.56